# EAGLE board csa_ultracpu (EAGLE 6.4), part 1 of 3
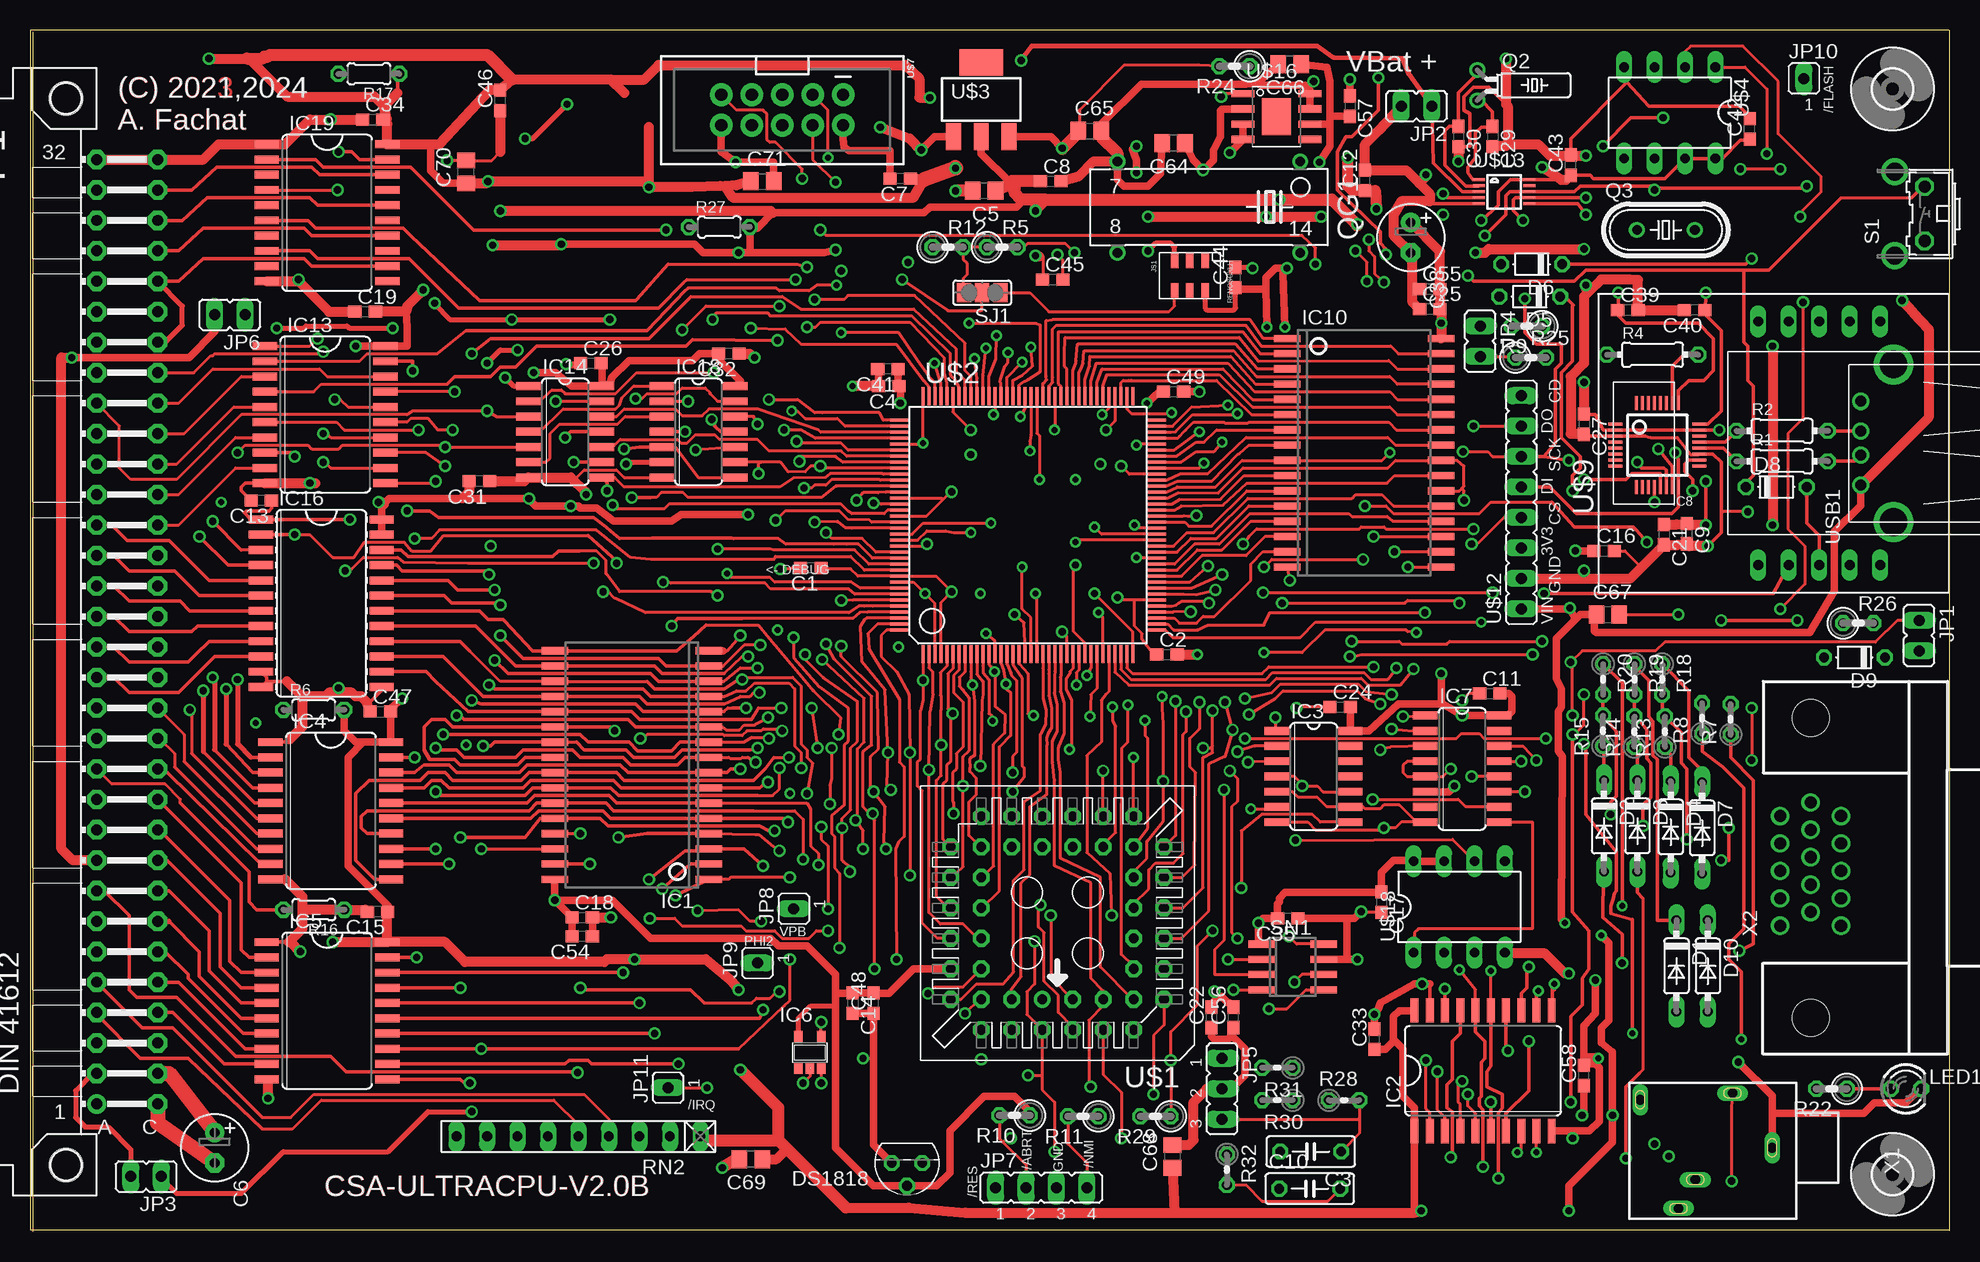
[diagram p7: board, top side]
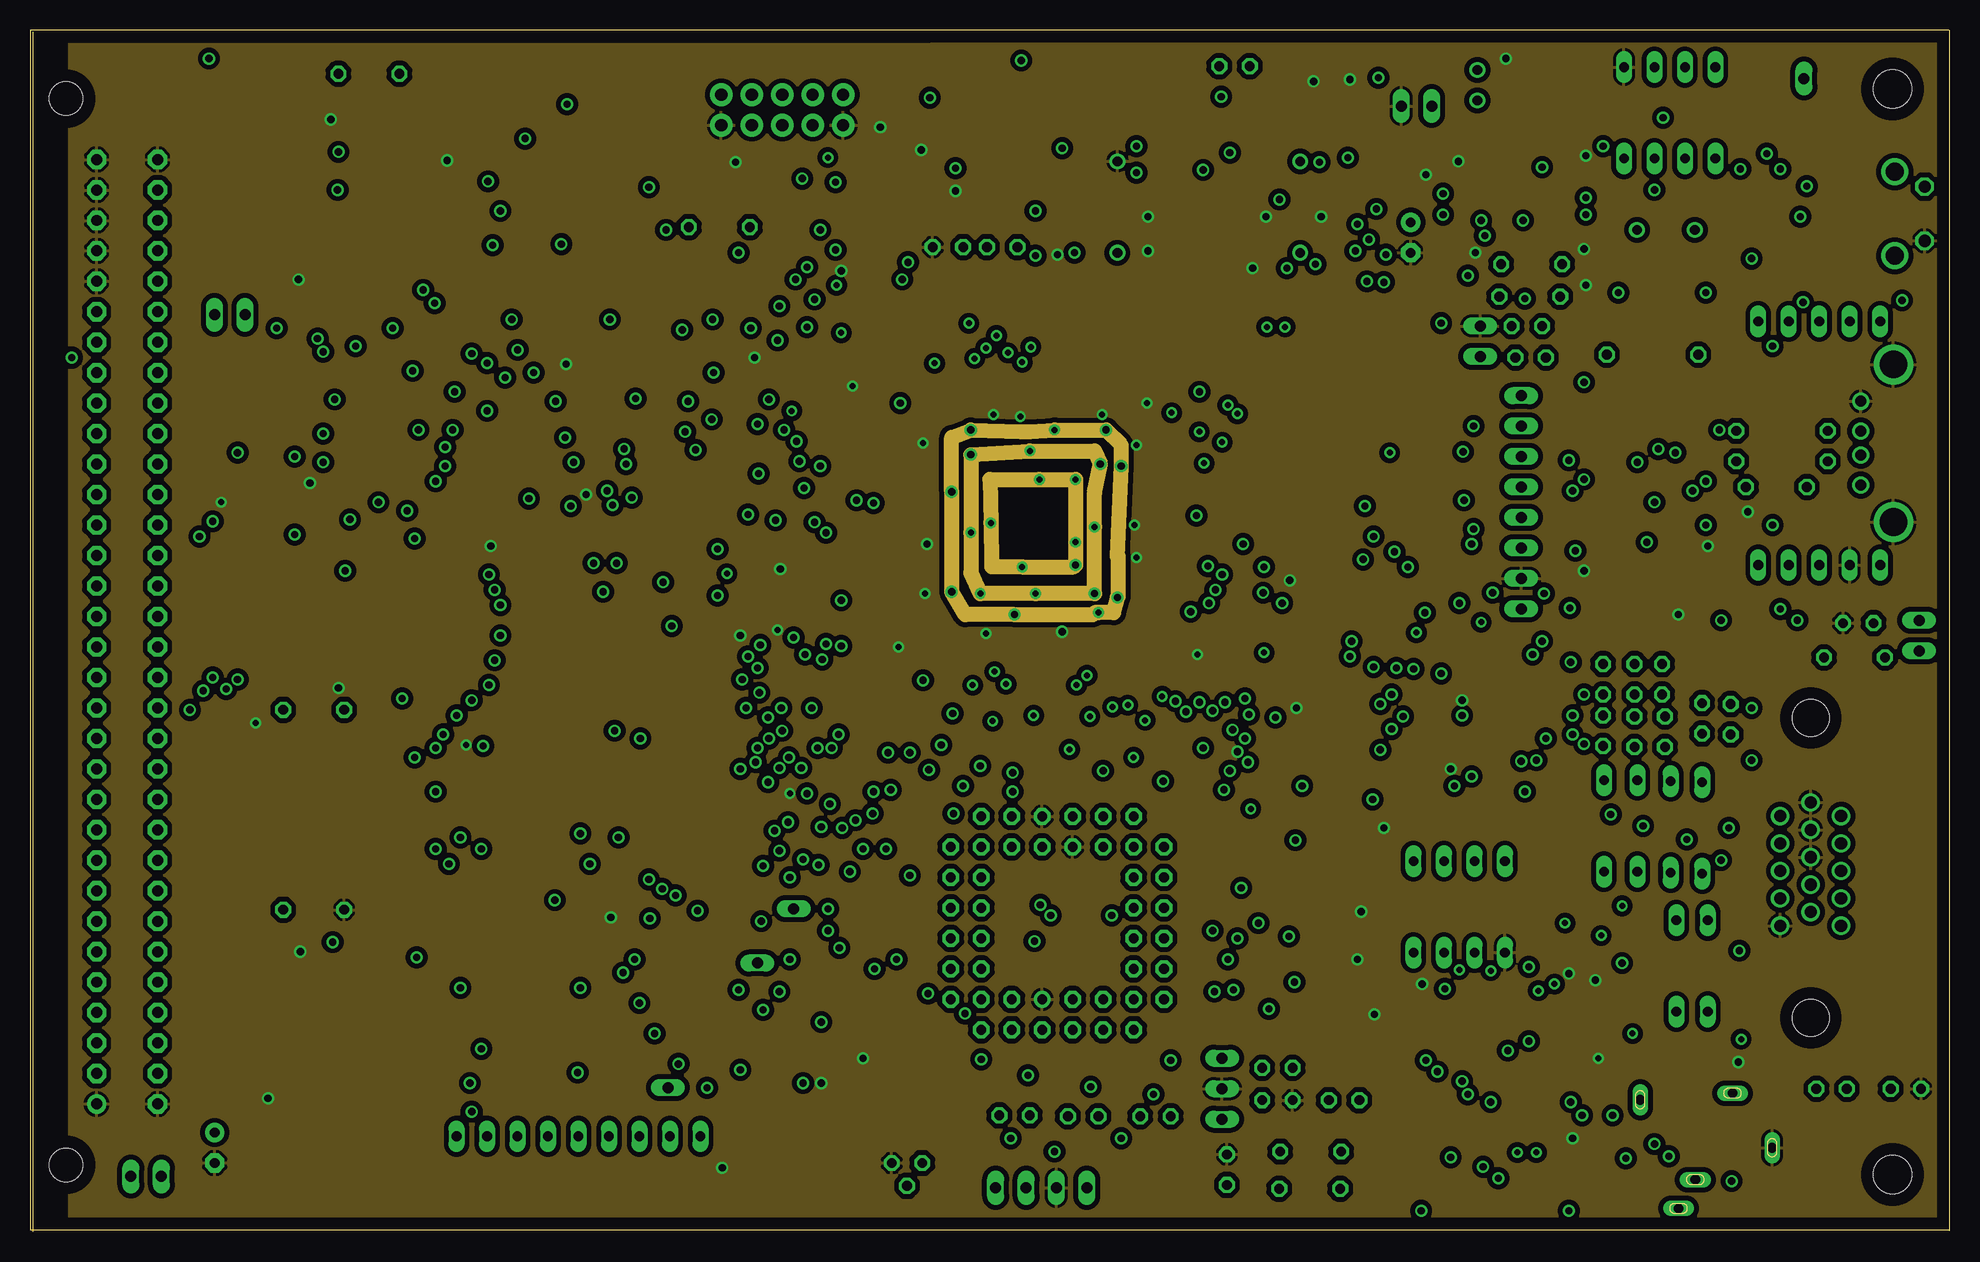
[diagram p8: board, inner layer Route2]
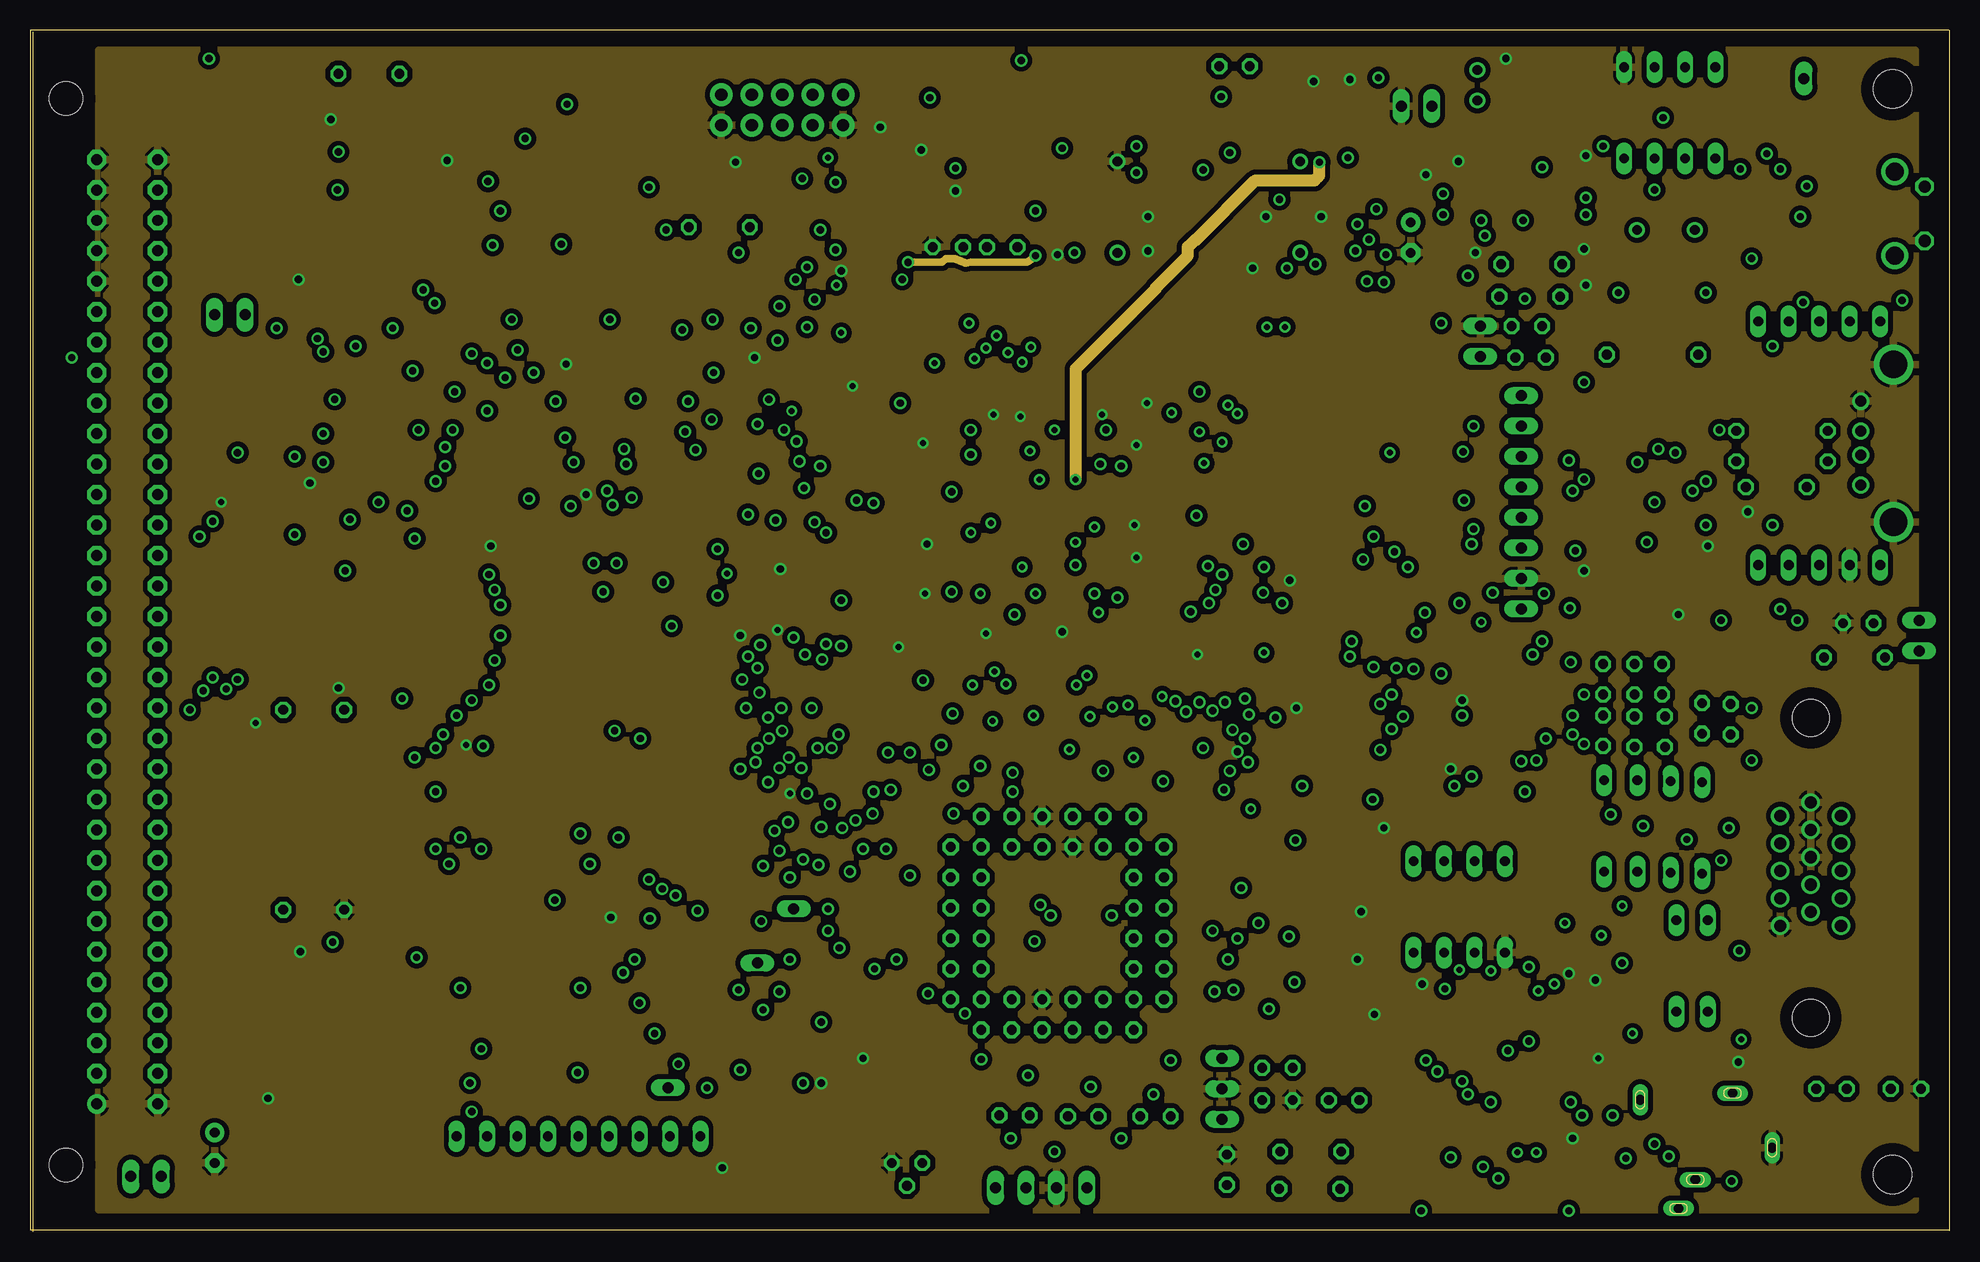
[diagram p9: board, inner layer Route15]
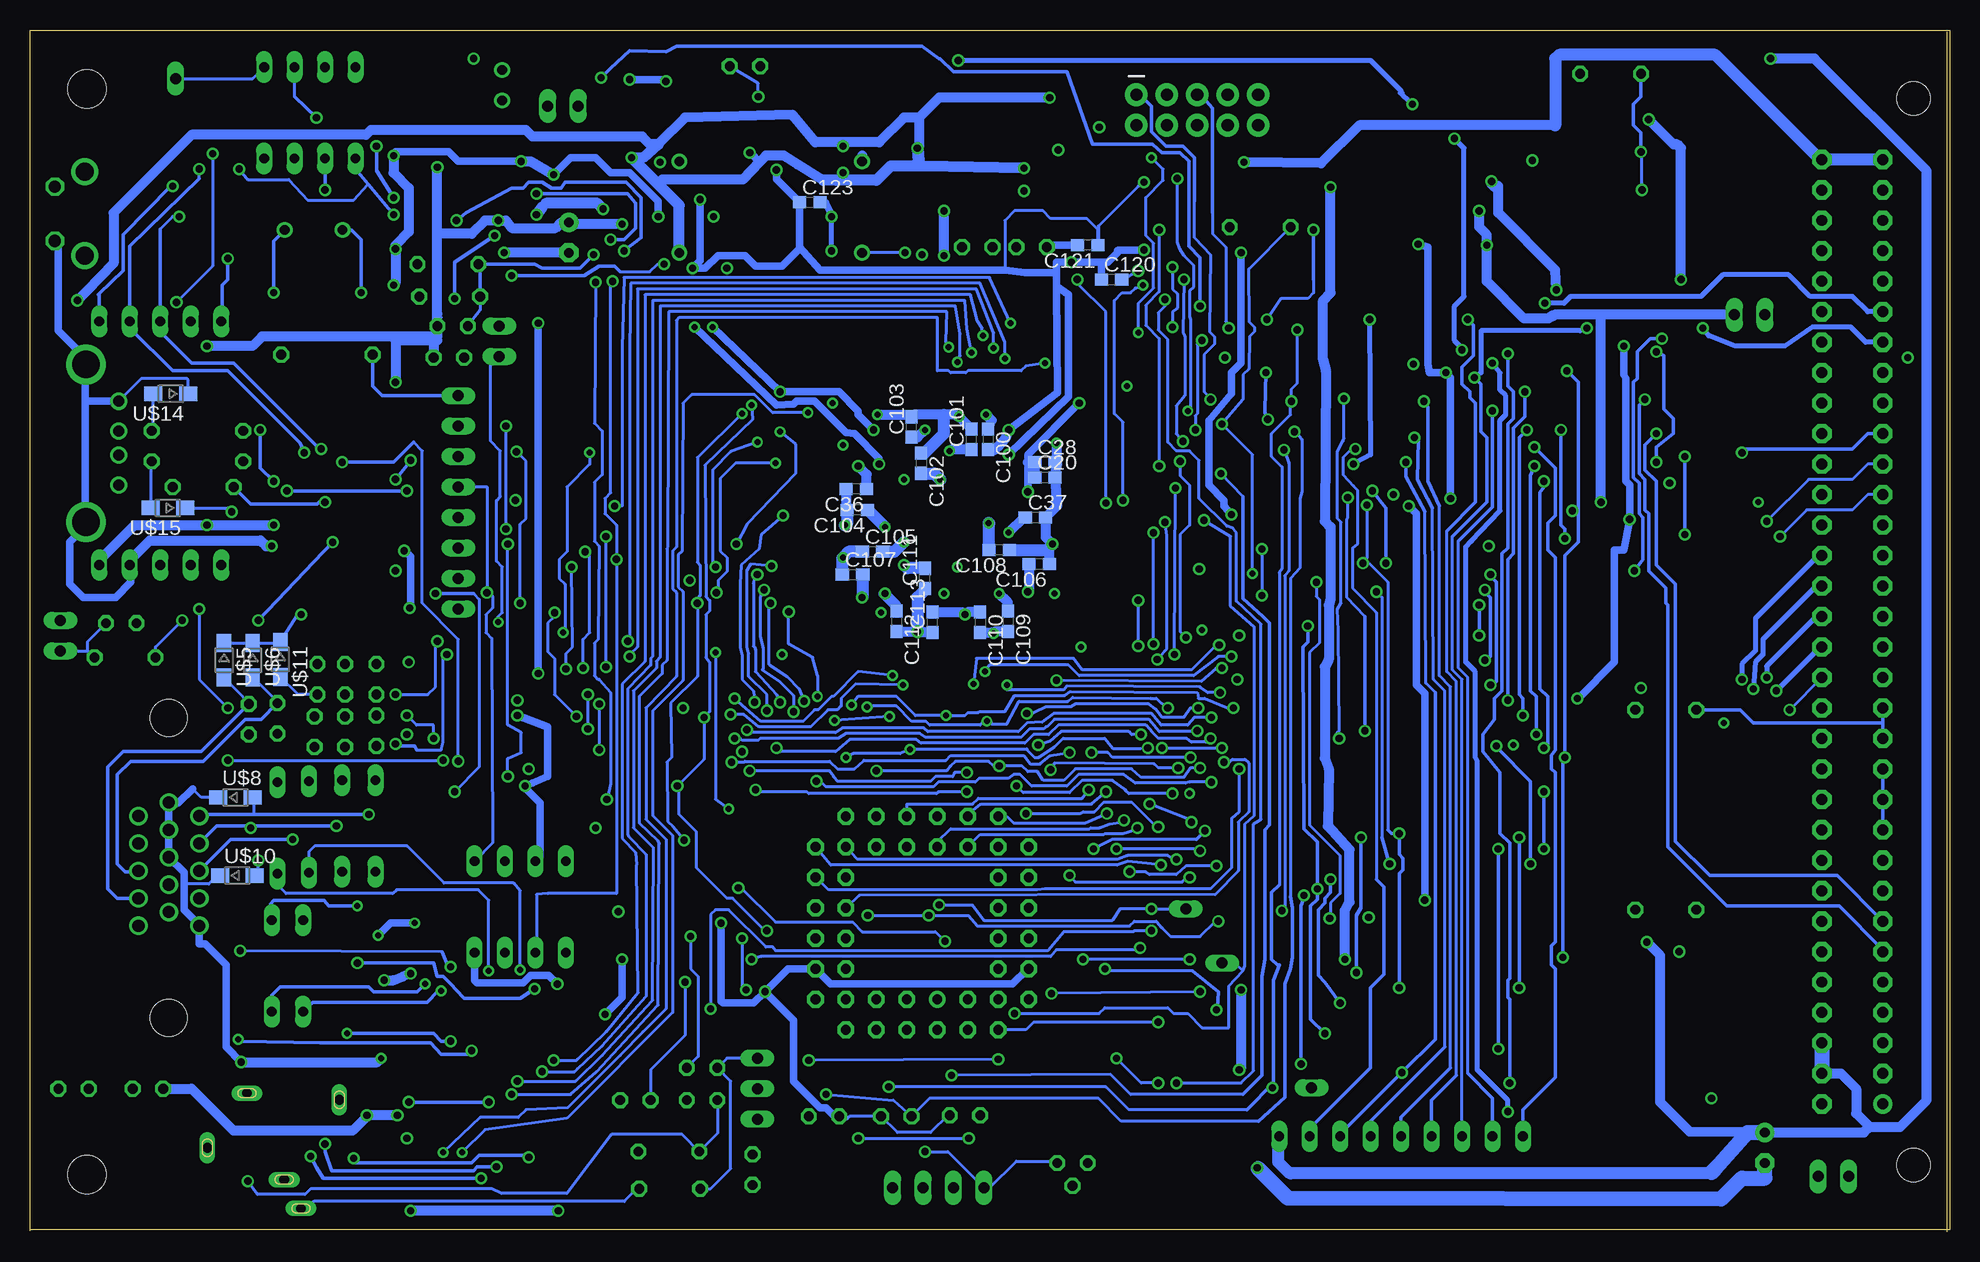
[diagram p10: board, bottom side, seen from below]

Size 160 x 100.18 mm. Coordinates in mm from the lower left corner, seen from the top.
Outline: 160,0.17 0,0.17 0,100.17 75,100.17 159.94,100.18
Outline: 160,0.09 160,100.17
Copper layers (1+2*15+16): Top 0.035mm / dielectric 0.2104mm / Route2 0.0152mm / dielectric 1.065mm / Route15 0.0152mm / dielectric 0.2104mm / Bottom 0.035mm
Design rules "default *": minimum track width 5mil, minimum drill 0.3mm, track to track 6mil, track to pad 6mil, pad to pad 6mil, via to via 6mil, smd to smd 6mil, copper to edge 40mil, drill to drill 8mil, minimum pad ring 10mil, minimum via ring 8mil, stop-mask expansion 4mil, vias tented up to drill 0mil, thermal gap 10mil
Net classes: 0 default: clearance 0.152 mm

## Footprints (pad centres in the part's own frame; a part is rotated, then mirrored left to right if it is on the bottom)
C0603 = smd 1.1 x 1: 1 -0.85,0; 2 0.85,0
C050-025X075 = drill 0.813 octagon: 1 -2.54,0; 2 2.54,0
C0805 = smd 1.3 x 1.5: 1 -0.95,0; 2 0.95,0
E2,5-6 = drill 0.813 pad 1.6: + -1.27,0 | drill 0.813 pad 1.6 octagon: - 1.27,0
DO35-7 = drill 0.813 long: A 3.81,0; C -3.81,0
D-5 = drill 0.813 octagon: A 2.54,0; C -2.54,0
TO92 = drill 0.813 octagon: 1 -1.27,1.27; 2 0,3.175; 3 1.27,1.27
3,2 = hole 3.2: 0,0
SOP32 = smd 0.6 x 2.2: 1 -8.89,-6.416; 2 -7.62,-6.416; 3 -6.35,-6.416; 4 -5.08,-6.416; 5 -3.81,-6.416; 6 -2.54,-6.416; 7 -1.27,-6.416; 8 0,-6.416; 9 1.27,-6.416; 10 2.54,-6.416; 11 3.81,-6.416; 12 5.08,-6.416; 13 6.35,-6.416; 14 7.62,-6.416; 15 8.89,-6.416; 16 10.16,-6.416; 17 10.16,6.416; 18 8.89,6.416; 19 7.62,6.416; 20 6.35,6.416; 21 5.08,6.416; 22 3.81,6.416; 23 2.54,6.416; 24 1.27,6.416; 25 0,6.416; 26 -1.27,6.416; 27 -2.54,6.416; 28 -3.81,6.416; 29 -5.08,6.416; 30 -6.35,6.416; 31 -7.62,6.416; 32 -8.89,6.416
SO20W = smd 0.66 x 2.032: 1 -5.715,-5.029; 2 -4.445,-5.029; 3 -3.175,-5.029; 4 -1.905,-5.029; 5 -0.635,-5.029; 6 0.635,-5.029; 7 1.905,-5.029; 8 3.175,-5.029; 9 4.445,-5.029; 10 5.715,-5.029; 11 5.715,5.029; 12 4.445,5.029; 13 3.175,5.029; 14 1.905,5.029; 15 0.635,5.029; 16 -0.635,5.029; 17 -1.905,5.029; 18 -3.175,5.029; 19 -4.445,5.029; 20 -5.715,5.029
SO14 = smd 0.66 x 2.032: 1 -3.81,-3.073; 2 -2.54,-3.073; 3 -1.27,-3.073; 4 0,-3.073; 5 1.27,-3.073; 6 2.54,-3.073; 7 3.81,-3.073; 8 3.81,3.073; 9 2.54,3.073; 10 1.27,3.073; 11 0,3.073; 12 -1.27,3.073; 13 -2.54,3.073; 14 -3.81,3.073
SOT23-5 = smd 0.69 x 0.99: 1 -0.95,-1.29; 2 0,-1.29; 3 0.95,-1.29; 4 0.95,1.3; 5 -0.95,1.3
SO16 = smd 0.66 x 2.032: 1 -4.445,-3.073; 2 -3.175,-3.073; 3 -1.905,-3.073; 4 -0.635,-3.073; 5 0.635,-3.073; 6 1.905,-3.073; 7 3.175,-3.073; 8 4.445,-3.073; 9 4.445,3.073; 10 3.175,3.073; 11 1.905,3.073; 12 0.635,3.073; 13 -0.635,3.073; 14 -1.905,3.073; 15 -3.175,3.073; 16 -4.445,3.073
TQFP32-5MM = smd 1.143 x 0.254: 1 -3.5,1.75; 2 -3.5,1.25; 3 -3.5,0.75; 4 -3.5,0.25; 5 -3.5,-0.25; 6 -3.5,-0.75; 7 -3.5,-1.25; 8 -3.5,-1.75; 17 3.5,-1.75; 18 3.5,-1.25; 19 3.5,-0.75; 20 3.5,-0.25; 21 3.5,0.25; 22 3.5,0.75; 23 3.5,1.25; 24 3.5,1.75 | smd 0.254 x 1.143: 9 -1.75,-3.5; 10 -1.25,-3.5; 11 -0.75,-3.5; 12 -0.25,-3.5; 13 0.25,-3.5; 14 0.75,-3.5; 15 1.25,-3.5; 16 1.75,-3.5; 25 1.75,3.5; 26 1.25,3.5; 27 0.75,3.5; 28 0.25,3.5; 29 -0.25,3.5; 30 -0.75,3.5; 31 -1.25,3.5; 32 -1.75,3.5
SO24L = smd 0.66 x 2.032: 1 -3.81,-5.029; 2 -2.54,-5.029; 3 -1.27,-5.029; 4 0,-5.029; 5 1.27,-5.029; 6 2.54,-5.029; 7 3.81,-5.029; 8 5.08,-5.029; 9 6.35,-5.029; 10 7.62,-5.029; 11 8.89,-5.029; 12 10.16,-5.029; 13 10.16,5.029; 14 8.89,5.029; 15 7.62,5.029; 16 6.35,5.029; 17 5.08,5.029; 18 3.81,5.029; 19 2.54,5.029; 20 1.27,5.029; 21 0,5.029; 22 -1.27,5.029; 23 -2.54,5.029; 24 -3.81,5.029
JP1 = drill 0.914 long: 1 0,-1.27; 2 0,1.27
JP2 = drill 0.914 long: 1 -2.54,0; 2 0,0; 3 2.54,0
JP4 = drill 0.914 long: 1 -3.81,0; 2 -1.27,0; 3 1.27,0; 4 3.81,0
PIN = drill 0.914 long: 1 0,0
RENJS6 = smd 0.635 x 1.27: 1 -3.81,-3.81; 2 -2.54,-3.81; 3 -1.27,-3.81; 4 -1.27,-1.27; 5 -2.54,-1.27; 6 -3.81,-1.27
LED3MM = drill 0.813 octagon: A -1.27,0; K 1.27,0
CSABUS = drill 0.914 pad 1.6: A1 7.62,36.83 | drill 0.914 pad 1.6 octagon: A2 7.62,34.29; A3 7.62,31.75; A4 7.62,29.21; A5 7.62,26.67; A6 7.62,24.13; A7 7.62,21.59; A8 7.62,19.05; A9 7.62,16.51; A10 7.62,13.97; A11 7.62,11.43; A12 7.62,8.89; A13 7.62,6.35; A14 7.62,3.81; A15 7.62,1.27; A16 7.62,-1.27; A17 7.62,-3.81; A18 7.62,-6.35; A19 7.62,-8.89; A20 7.62,-11.43; A21 7.62,-13.97; A22 7.62,-16.51; A23 7.62,-19.05; A24 7.62,-21.59; A25 7.62,-24.13; A26 7.62,-26.67; A27 7.62,-29.21; A28 7.62,-31.75; A29 7.62,-34.29; A30 7.62,-36.83; A31 7.62,-39.37; A32 7.62,-41.91; C1 2.54,36.83; C2 2.54,34.29; C3 2.54,31.75; C4 2.54,29.21; C5 2.54,26.67; C6 2.54,24.13; C7 2.54,21.59; C8 2.54,19.05; C9 2.54,16.51; C10 2.54,13.97; C11 2.54,11.43; C12 2.54,8.89; C13 2.54,6.35; C14 2.54,3.81; C15 2.54,1.27; C16 2.54,-1.27; C17 2.54,-3.81; C18 2.54,-6.35; C19 2.54,-8.89; C20 2.54,-11.43; C21 2.54,-13.97; C22 2.54,-16.51; C23 2.54,-19.05; C24 2.54,-21.59; C25 2.54,-24.13; C26 2.54,-26.67; C27 2.54,-29.21; C28 2.54,-31.75; C29 2.54,-34.29; C30 2.54,-36.83; C31 2.54,-39.37; C32 2.54,-41.91 | hole 2.794: 10.16,41.91; 10.16,-46.99
TC26H = drill 0.813: 1 -1.27,0; 2 1.27,0
HC49/S = drill 0.813: 1 -2.413,0; 2 2.413,0
SG51 = drill 0.813: 1 -7.62,-3.81; 7 7.62,-3.81; 8 7.62,3.81; 14 -7.62,3.81
0204/7 = drill 0.813 octagon: 1 -3.81,0; 2 3.81,0
0207/2V = drill 0.813 octagon: 1 -1.27,0; 2 1.27,0
0204/5 = drill 0.813 octagon: 1 -2.54,0; 2 2.54,0
0204V = drill 0.813 octagon: 1 -1.27,0; 2 1.27,0
RN-9 = drill 0.813 long: 1 -10.16,0; 2 -7.62,0; 3 -5.08,0; 4 -2.54,0; 5 0,0; 6 2.54,0; 7 5.08,0; 8 7.62,0; 9 10.16,0
B3F-31XX = drill 1.016 octagon: 1 -2.261,-1.245; 2 2.261,-1.245 | drill 1.499 pad 2.159: 3 -3.505,1.245; 4 3.505,1.245
SJ_2 = smd 1.168 x 1.6: 1 -1.524,0; 2 0,0; 3 1.524,0
SOIC8 = smd 0.6 x 2.2: 1 -1.905,-2.6; 2 -0.635,-2.6; 3 0.635,-2.6; 4 1.905,-2.6; 5 1.905,2.6; 6 0.635,2.6; 7 -0.635,2.6; 8 -1.905,2.6
PLCC44 = drill 0.813 pad 1.397: 1 1.27,6.35 | drill 0.813 pad 1.397 octagon: 2 -1.27,8.89; 3 -1.27,6.35; 4 -3.81,8.89; 5 -3.81,6.35; 6 -6.35,8.89; 7 -8.89,6.35; 8 -6.35,6.35; 9 -8.89,3.81; 10 -6.35,3.81; 11 -8.89,1.27; 12 -6.35,1.27; 13 -8.89,-1.27; 14 -6.35,-1.27; 15 -8.89,-3.81; 16 -6.35,-3.81; 17 -8.89,-6.35; 18 -6.35,-8.89; 19 -6.35,-6.35; 20 -3.81,-8.89; 21 -3.81,-6.35; 22 -1.27,-8.89; 23 -1.27,-6.35; 24 1.27,-8.89; 25 1.27,-6.35; 26 3.81,-8.89; 27 3.81,-6.35; 28 6.35,-8.89; 29 8.89,-6.35; 30 6.35,-6.35; 31 8.89,-3.81; 32 6.35,-3.81; 33 8.89,-1.27; 34 6.35,-1.27; 35 8.89,1.27; 36 6.35,1.27; 37 8.89,3.81; 38 6.35,3.81; 39 8.89,6.35; 40 6.35,8.89; 41 6.35,6.35; 42 3.81,8.89; 43 3.81,6.35; 44 1.27,8.89
TQFP144 = smd 0.27 x 1.5: 1 -8.75,-12.02; 2 -8.25,-12.02; 3 -7.75,-12.02; 4 -7.25,-12.02; 5 -6.75,-12.02; 6 -6.25,-12.02; 7 -5.75,-12.02; 8 -5.25,-12.02; 9 -4.75,-12.02; 10 -4.25,-12.02; 11 -3.75,-12.02; 12 -3.25,-12.02; 13 -2.75,-12.02; 14 -2.25,-12.02; 15 -1.75,-12.02; 16 -1.25,-12.02; 17 -0.75,-12.02; 18 -0.25,-12.02; 19 0.25,-12.02; 20 0.75,-12.02; 21 1.25,-12.02; 22 1.75,-12.02; 23 2.25,-12.02; 24 2.75,-12.02; 25 3.25,-12.02; 26 3.75,-12.02; 27 4.25,-12.02; 28 4.75,-12.02; 29 5.25,-12.02; 30 5.75,-12.02; 31 6.25,-12.02; 32 6.75,-12.02; 33 7.25,-12.02; 34 7.75,-12.02; 35 8.25,-12.02; 36 8.75,-12.02; 73 8.75,9.48; 74 8.25,9.48; 75 7.75,9.48; 76 7.25,9.48; 77 6.75,9.48; 78 6.25,9.48; 79 5.75,9.48; 80 5.25,9.48; 81 4.75,9.48; 82 4.25,9.48; 83 3.75,9.48; 84 3.25,9.48; 85 2.75,9.48; 86 2.25,9.48; 87 1.75,9.48; 88 1.25,9.48; 89 0.75,9.48; 90 0.25,9.48; 91 -0.25,9.48; 92 -0.75,9.48; 93 -1.25,9.48; 94 -1.75,9.48; 95 -2.25,9.48; 96 -2.75,9.48; 97 -3.25,9.48; 98 -3.75,9.48; 99 -4.25,9.48; 100 -4.75,9.48; 101 -5.25,9.48; 102 -5.75,9.48; 103 -6.25,9.48; 104 -6.75,9.48; 105 -7.25,9.48; 106 -7.75,9.48; 107 -8.25,9.48; 108 -8.75,9.48 | smd 1.5 x 0.27: 37 10.75,-10.02; 38 10.75,-9.52; 39 10.75,-9.02; 40 10.75,-8.52; 41 10.75,-8.02; 42 10.75,-7.52; 43 10.75,-7.02; 44 10.75,-6.52; 45 10.75,-6.02; 46 10.75,-5.52; 47 10.75,-5.02; 48 10.75,-4.52; 49 10.75,-4.02; 50 10.75,-3.52; 51 10.75,-3.02; 52 10.75,-2.52; 53 10.75,-2.02; 54 10.75,-1.52; 55 10.75,-1.02; 56 10.75,-0.52; 57 10.75,-0.02; 58 10.75,0.48; 59 10.75,0.98; 60 10.75,1.48; 61 10.75,1.98; 62 10.75,2.48; 63 10.75,2.98; 64 10.75,3.48; 65 10.75,3.98; 66 10.75,4.48; 67 10.75,4.98; 68 10.75,5.48; 69 10.75,5.98; 70 10.75,6.48; 71 10.75,6.98; 72 10.75,7.48; 109 -10.75,7.48; 110 -10.75,6.98; 111 -10.75,6.48; 112 -10.75,5.98; 113 -10.75,5.48; 114 -10.75,4.98; 115 -10.75,4.48; 116 -10.75,3.98; 117 -10.75,3.48; 118 -10.75,2.98; 119 -10.75,2.48; 120 -10.75,1.98; 121 -10.75,1.48; 122 -10.75,0.98; 123 -10.75,0.48; 124 -10.75,-0.02; 125 -10.75,-0.52; 126 -10.75,-1.02; 127 -10.75,-1.52; 128 -10.75,-2.02; 129 -10.75,-2.52; 130 -10.75,-3.02; 131 -10.75,-3.52; 132 -10.75,-4.02; 133 -10.75,-4.52; 134 -10.75,-5.02; 135 -10.75,-5.52; 136 -10.75,-6.02; 137 -10.75,-6.52; 138 -10.75,-7.02; 139 -10.75,-7.52; 140 -10.75,-8.02; 141 -10.75,-8.52; 142 -10.75,-9.02; 143 -10.75,-9.52; 144 -10.75,-10.02
SOT223 = smd 1.219 x 2.235: 1 -2.311,-3.099; 2 0,-3.099; 3 2.311,-3.099 | smd 3.6 x 2.2: 4 0,3.099
DIL08 = drill 0.813 long: 1 -11.43,-2.54; 2 -8.89,-2.54; 3 -6.35,-2.54; 4 -3.81,-2.54; 5 -3.81,5.08; 6 -6.35,5.08; 7 -8.89,5.08; 8 -11.43,5.08
SOD323 = smd 1.5 x 1.2: 1 -1.45,0; 2 1.45,0
FLAT10BOX = drill 1.016 pad 1.88: 1 -1.27,5.08; 2 1.27,5.08; 3 -1.27,2.54; 4 1.27,2.54; 5 -1.27,0; 6 1.27,0; 7 -1.27,-2.54; 8 1.27,-2.54; 9 -1.27,-5.08; 10 1.27,-5.08
ETHOLIENC = drill 0.813 long: 1_1 15.24,10.16; 1_2 12.7,10.16; 1_3 10.16,10.16; 1_4 7.62,10.16; 1_5 5.08,10.16; 2_1 5.08,-10.16; 2_2 7.62,-10.16; 2_3 10.16,-10.16; 2_4 12.7,-10.16; 2_5 15.24,-10.16
GRAVITECH-SDCARD = drill 0.914 long: 3V3 -3.81,0; CD 8.89,0; CS -1.27,0; DI 1.27,0; DO 6.35,0; GND -6.35,0; SCK 3.81,0; VIN -8.89,0
MSOP10 = smd 0.25 x 1: 1 -1,-2.113; 2 -0.5,-2.113; 3 0,-2.113; 4 0.5,-2.113; 5 1,-2.113; 6 1,2.113; 7 0.5,2.113; 8 0,2.113; 9 -0.5,2.113; 10 -1,2.113
PSOP-8-FIXED = smd 1.91 x 0.61: 1 -2.78,1.905; 2 -2.78,0.635; 3 -2.78,-0.635; 4 -2.78,-1.905; 5 2.78,-1.905; 6 2.78,-0.635; 7 2.78,0.635; 8 2.78,1.905 | smd 2.41 x 3.1: PAD 0,0
USB-A-H = drill 0.914: D+ 2.718,-1.003; D- 2.718,1.003; GND 2.718,-3.493; VBUS 2.718,3.493 | drill 2.311: GND@1 0,6.566; GND@2 0,-6.566
1503_09 = drill 0.8 pad 1.2 long: 1 0,-2.1; 2 -4.55,-5.4; 3 5.05,-9.9; 4 -4,-13.1; 5 2.65,-8.5
HDR15RA = drill 1.016: 1 4.318,2.54; 2 2.032,2.54; 3 -0.254,2.54; 4 -2.54,2.54; 5 -4.826,2.54; 6 5.461,0; 7 3.175,0; 8 0.889,0; 9 -1.397,0; 10 -3.683,0; 11 4.318,-2.54; 12 2.032,-2.54; 13 -0.254,-2.54; 14 -2.54,-2.54; 15 -4.826,-2.54 | hole 3.048: -12.497,0; 12.497,0

## Placement (x,y rotation side)
C1  1u  [C0603]  65.08,55.33 180 top
C2  0.1u  [C0603]  94.77,48.11 0 top
C3  1u  [C050-025X075]  106.75,6.67 180 top
C4  1u  [C0603]  71.59,70.49 180 top
C5  22u  [C0805]  79.53,86.76 180 top
C6  47u  [E2,5-6]  15.39,6.99 270 top
C7  100n  [C0603]  72.54,87.8 180 top
C8  100n  [C0603]  85.08,87.56 0 top
C9  1.0u Cer  [C0603]  138.11,58.19 270 top
C10  1u  [C050-025X075]  106.67,3.58 0 top
C11  0.1u  [C0603]  121.68,44.85 0 top
C12  0.1u  [C0603]  111.28,87.64 90 top
C13  0.1u  [C0603]  19.28,60.97 180 top
C14  1u  [C0603]  68.57,19.06 270 top
C15  0.1u  [C0603]  28.97,26.68 180 top
C16  0.1u  [C0603]  131.2,56.76 0 top
C17  0.1u  [C0603]  112.63,27.47 270 top
C18  0.1u  [C0603]  46.03,26.2 0 top
C19  0.1u  [C0603]  27.93,76.68 0 top
C20  0.1u  [C0603]  75.4,62.87 0 bottom
C21  0.1u  [C0603]  136.2,58.11 270 top
C22  0.1u  [C0603]  98.5,17.87 90 top
C24  0.1u  [C0603]  109.21,43.74 0 top
C25  0.1u  [C0603]  116.68,76.92 0 top
C26  0.1u  [C0603]  46.75,72.4 0 top
C27  0.1u  [C0603]  129.53,67.32 270 top
C28  0.1u  [C0603]  75.4,64.14 0 bottom
C29  18p  [C0603]  121.91,91.29 270 top
C30  18p  [C0603]  119.06,91.29 270 top
C31  0.1u  [C0603]  37.46,62.55 180 top
C32  0.1u  [C0603]  58.26,73.19 180 top
C33  0.1u  [C0603]  112.07,16.04 90 top
C34  0.1u  [C0603]  28.57,92.72 0 top
C35  0.1u  [C0603]  104.85,26.12 180 top
C36  0.1u  [C0603]  91.12,61.92 180 bottom
C37  0.1u  [C0603]  76.19,59.54 0 bottom
C38  22u  [E2,5-6]  115.09,82.87 270 top
C39  18p  [C0603]  133.19,76.84 0 top
C40  18p  [C0603]  138.74,76.84 180 top
C41  0.1u  [C0603]  71.51,71.92 180 top
C42  0.1u  [C0603]  143.35,91.92 90 top
C43  0.1u  [C0603]  128.42,88.91 90 top
C44  0.1u  [C0603]  100.48,79.54 90 top
C45  0.1u  [C0603]  85.24,79.38 0 top
C46  0.1u  [C0603]  39.21,94.3 90 top
C47  0.1u  [C0603]  29.2,43.35 0 top
C48  0.1u  [C0603]  70.32,19.06 90 top
C49  1u  [C0603]  95.32,70.02 0 top
C54  1u  [C0603]  46.03,24.61 180 top
C55  1u  [C0603]  116.68,78.59 0 top
C56  1u  [C0603]  100.32,17.87 90 top
C57  1u  [C0603]  110.01,93.83 270 top
C58  0.1u  [C0603]  129.53,13.02 90 top
C64  22u  [C0805]  95.32,90.73 180 top
C65  22u  [C0805]  88.34,91.76 0 top
C66  22u  [C0805]  105.01,97.32 180 top
C67  22u  [C0805]  131.52,51.44 0 top
C68  22u  [C0805]  95.24,6.28 90 top
C69  22u  [C0805]  60.08,6.04 180 top
C70  22u  [C0805]  36.35,88.35 90 top
C71  22u  [C0805]  61.03,87.56 0 top
C100  0.1u  [C0603]  80.16,66.05 270 bottom
C101  0.1u  [C0603]  81.51,66.05 90 bottom
C102  0.1u  [C0603]  85.72,64.06 270 bottom
C103  0.1u  [C0603]  86.51,67.08 90 bottom
C104  0.1u  [C0603]  91.04,60.17 180 bottom
C105  0.1u  [C0603]  89.77,56.68 0 bottom
C106  0.1u  [C0603]  75.88,55.65 180 bottom
C107  0.1u  [C0603]  91.44,54.78 0 bottom
C108  0.1u  [C0603]  79.21,56.84 180 bottom
C109  0.1u  [C0603]  78.5,50.89 270 bottom
C110  0.1u  [C0603]  80.8,50.81 270 bottom
C111  0.1u  [C0603]  85.4,54.46 90 bottom
C112  0.1u  [C0603]  87.78,50.89 270 bottom
C113  0.1u  [C0603]  84.77,50.81 90 bottom
C120  1u  [C0603]  69.84,79.38 0 bottom
C121  1u  [C0603]  71.83,82.24 180 bottom
C123  1u  [C0603]  95.01,85.81 0 bottom
D1  1N4148DO35-7  [DO35-7]  137.23,22.15 270 top
D2  1N4148DO35-7  [DO35-7]  131.2,33.82 270 top
D3  1N4148DO35-7  [DO35-7]  133.98,33.82 270 top
D4  1N4148DO35-7  [DO35-7]  136.76,33.74 270 top
D5  1N4148  [D-5]  125.01,77.95 180 top
D6  1N4148  [D-5]  125.17,80.65 180 top
D7  1N4148DO35-7  [DO35-7]  139.38,33.66 270 top
D8  1N4148  [D-5]  145.57,62.08 0 top
D9  1N4148  [D-5]  152.08,47.87 180 top
D10  1N4148DO35-7  [DO35-7]  139.85,22.15 270 top
DS1818  DS1818  [TO92]  73.1,6.99 180 top
H3  MOUNT-HOLE3.2  [3,2]  155.25,95.26 0 top
H4  MOUNT-HOLE3.2  [3,2]  155.25,4.77 0 top
IC1  RAMSOCK32TO512KSOP  [SOP32]  50.16,38.27 90 top
IC2  74HCT245DW  [SO20W]  121.12,13.42 0 top
IC3  74LVC125  [SO14]  106.99,37.95 270 top
IC4  74HCT245DW  [SO20W]  25.08,35.09 270 top
IC5  74HCT245DW  [SO20W]  24.76,18.42 270 top
IC6  74LVC1G04DBV  [SOT23-5]  65,14.93 0 top
IC7  74LVC138  [SO16]  119.38,38.58 270 top
IC8  MAX3421E  [TQFP32-5MM]  135.65,65.57 0 top
IC10  RAMSOCK32TO512KSOP  [SOP32]  111.2,65.57 270 top
IC13  74HCT244DW  [SO20W]  24.6,68.11 270 top
IC14  74LVC14  [SO14]  44.6,66.68 270 top
IC16  74LVC8T245SO24  [SO24L]  24.28,55.57 270 top
IC18  74LVC06  [SO14]  55.72,66.68 270 top
IC19  74HCT244DW  [SO20W]  24.76,84.94 270 top
JP1  [JP1]  157.47,49.7 180 top
JP2  [JP1]  115.56,93.83 90 top
JP3  [JP1]  9.68,4.61 90 top
JP4  [JP1]  120.88,74.22 180 top
JP5  [JP2]  99.37,11.91 270 top
JP6  [JP1]  16.66,76.44 90 top
JP7  [JP4]  84.29,3.66 0 top
JP8  PIN  [PIN]  63.65,26.91 90 top
JP9  PIN  [PIN]  60.64,22.39 90 top
JP10  PIN  [PIN]  147.87,96.13 0 top
JP11  PIN  [PIN]  53.18,11.99 90 top
JS1  RENOSCXLH  [RENJS6]  94.13,77.16 180 top
LED1  [LED3MM]  156.36,11.91 0 top
P1  CSABUS  [CSABUS]  13.17,47.47 180 top
Q2  32kHz  [TC26H]  120.64,95.57 270 top
Q3  12MHz  [HC49/S]  136.36,83.51 0 top
QG1  50MHz  [SG51]  98.26,85.41 180 top
R1  33  [0204/7]  146.04,64.22 0 top
R2  33  [0204/7]  146.04,66.76 0 top
R4  33  [0204/7]  135.25,73.11 0 top
R5  1k  [0207/2V]  81.04,82.08 0 top
R6  10k  [0204/5]  23.65,43.5 0 top
R7  68  [0204V]  141.76,42.71 90 top
R8  68  [0204V]  139.38,42.79 90 top
R9  10k  [0207/2V]  124.77,75.49 180 top
R10  10k  [0207/2V]  82.07,9.69 180 top
R11  10k  [0207/2V]  87.78,9.61 180 top
R12  1k5  [0207/2V]  76.51,82.08 0 top
R13  470  [0204V]  136.28,41.68 90 top
R14  470  [0204V]  133.74,41.68 90 top
R15  470  [0204V]  131.12,41.76 90 top
R16  10k  [0204/5]  23.65,26.84 180 top
R17  10k  [0204/5]  28.25,96.53 180 top
R18  1k  [0204V]  136.04,46.04 270 top
R19  1k  [0204V]  133.74,46.04 270 top
R20  1k  [0204V]  131.12,46.04 270 top
R22  390  [0207/2V]  150.17,11.91 180 top
R24  10k  [0207/2V]  100.4,97.16 180 top
R25  4k7  [0207/2V]  125.09,72.87 0 top
R26  10k  [0207/2V]  152.39,50.73 0 top
R27  10k  [0204/5]  57.46,83.75 0 top
R28  100  [0204V]  109.53,10.96 0 top
R29  330  [0207/2V]  93.82,9.61 180 top
R30  680  [0204V]  103.98,10.96 180 top
R31  100  [0204V]  103.98,13.66 180 top
R32  680  [0204V]  99.77,5.17 270 top
RN2  10k  [RN-9]  45.72,7.94 180 top
S1  [B3F-31XX]  156.68,84.86 90 top
SJ1  [SJ_2]  79.37,78.27 180 top
SN1  MCP48X2  [SOIC8]  105.25,22.07 270 top
U$1  W65C816SPLCC  [PLCC44]  85.64,25.72 180 top
U$2  XC6SLX9-TQG144  [TQFP144]  83.18,60.17 0 top
U$3  LDI1117  [SOT223]  79.29,94.38 0 top
U$4  SPIFLASH  [DIL08]  129.06,94.54 180 top
U$5  PESD5V0L1BA  [SOD323]  143.82,47.63 270 bottom
U$6  PESD5V0L1BA  [SOD323]  141.44,47.63 270 bottom
U$7  XILINXPROG  [FLAT10BOX]  62.7,93.51 270 top
U$8  PESD5V0L1BA  [SOD323]  142.87,36.2 0 bottom
U$9  ETHOLIENC  [ETHOLIENC]  138.98,65.73 0 top
U$10  PESD5V0L1BA  [SOD323]  142.71,29.69 0 bottom
U$11  PESD5V0L1BA  [SOD323]  139.14,47.71 270 bottom
U$12  SD-CARD-GRAVI  [GRAVITECH-SDCARD]  124.3,60.81 90 top
U$13  MCP79510  [MSOP10]  122.87,86.68 270 top
U$14  PESD5V0L1BA  [SOD323]  148.27,69.86 180 bottom
U$15  PESD5V0L1BA  [SOD323]  148.51,60.33 180 bottom
U$16  AP2132B-1.2  [PSOP-8-FIXED]  103.9,92.95 0 top
U$18  SPIFLASH  [DIL08]  126.76,25.8 0 top
USB1  USB-A-H  [USB-A-H]  155.33,65.73 180 top
X1  SJ1-3513N  [1503_09]  147.31,6.99 270 top
X2  D-SUB15-HDR15RA  [HDR15RA]  148.43,30.33 90 top

## Tracks (layer width: path | path; a pad name or v marks a point on that pad's centre or on a via)
12MHZ  (via drill 0.6)
  Top 0.305: v139.69,78.27 139.69,77.69 C40.1 139.75,76.31 140.97,75.1 140.97,68.43 139.85,67.32 IC8.24
  Bottom 0.305: Q3.2 138.77,83.48 139.69,82.56 v139.69,78.27
50M  (via drill 0.6)
  Top 0.254: v72.7,79.38 76.51,76.76 79.21,76.76 79.37,76.84 SJ1.2 | v70.32,60.73 70.95,60.64 70.95,60.65 U$2.123
  Bottom 0.254: v70.32,60.73 70.32,76.68 72.54,78.91 v72.7,79.38
50MCAN
  Top 0.254: 80.16,81.68 R5.1 R12.2 77.78,81.05 78.1,80.73 78.1,79.78 77.78,79.46 77.78,78.33 SJ1.3
50MSMD
  Top 0.254: SJ1.1 83.34,78.27 84.93,76.68 94.93,76.68 95.4,77.16 JS1.4
/BBE  (via drill 0.6)
  Top 0.305: P1.A8 6.19,28.42 8.25,26.36 8.25,20.17 8.89,19.53 12.22,19.53 17.14,14.61 25.08,14.61 26.35,13.34 45.56,13.34 v45.64,13.26 | IC14.9 v45.32,64.14
  Bottom 0.254: 42.86,44.93 43.65,45.73 43.73,60.01
  Bottom 0.305: RN2.3 50.8,8.1 v45.64,13.26 42.86,16.04 42.86,44.93 | 43.73,60.01 45.32,62.95 v45.32,64.14
/BE  (via drill 0.6)
  Top 0.254: IC6.2 65,12.94 v64.45,12.39 | U$2.100 78.43,71.27 77.94,71.76 77.94,74.06 73.73,78.03 68.18,78.03 67.86,77.71 v65.4,77.71
  Bottom 0.254: v64.45,12.39 59.05,12.39 58.02,13.42 58.02,33.98 57.38,34.38 57.38,50.65 59.45,52.55 59.45,58.27 59.76,58.66 60.24,58.82 62.54,61.13 62.54,64.3 63.34,65.09 64.45,65.09 65.16,65.81 65.16,74.38 65.96,75.17 65.96,76.6 65.4,77.16 v65.4,77.71
/BE_DOUT  (via drill 0.6)
  Top 0.254: 45.79,56.76 47.22,56.76 48.02,55.97 48.02,54.85 49.13,53.35 56.75,53.35 v57.3,53.03 | v57.3,56.92 61.67,56.92 61.99,56.84 68.57,56.84 68.74,56.83 69.92,55.65 U$2.133
  Top 0.305: IC16.22 30.95,56.84 31.51,56.28 43.57,56.28 44.05,56.76 45.79,56.76
  Bottom 0.254: v57.3,56.92 v57.3,53.03
/BE_OUT  (via drill 0.6)
  Top 0.254: 58.65,57.79 62.38,57.79 63.02,57.32 66.99,57.32 68.09,57.31 68.1,57.32 69.05,57.32 70.21,56.15 U$2.132
  Top 0.305: IC5.19 v32.22,22.87 | v32.06,39.54 IC4.19 | IC13.19 31.9,72.56 v31.9,71.76 | 58.65,57.79 58.48,57.8 51.84,57.8 49.13,57.79 48.41,58.43 48.02,58.74 46.98,59.54 34.05,59.54 33.33,60.09 v31.43,60.09
  Bottom 0.305: v32.22,22.87 32.22,39.38 v32.06,39.54 32.06,56.36 30.95,57.47 30.95,60.09 | 30.95,60.09 30.95,70.81 v31.9,71.76 | v31.43,60.09 30.95,60.09
/BEXTIO  (via drill 0.6)
  Top 0.254: 19.36,9.53 21.74,9.53 23.65,11.44 46.19,11.44 48.26,9.37 RN2.4
  Top 0.305: P1.A5 9.36,16.99 11.9,16.99 19.36,9.53 | v44.6,66.21 45.08,66.68 IC14.11
  Bottom 0.254: 42.06,15.41 42.06,45.09 43.02,46.04 43.1,60.33
  Bottom 0.305: RN2.4 48.26,9.21 42.06,15.41 | 43.1,60.33 44.37,62.71 44.29,66.05 v44.6,66.21
/BIOINH  (via drill 0.6)
  Top 0.254: 19.36,8.58 21.9,8.58 24.28,10.96 43.65,10.96 45.72,8.9 RN2.5 | v43.81,69.22 IC14.13
  Top 0.305: 5.55,18.1 9.2,14.45 13.17,14.45 19.36,8.58
  Top 0.406: P1.A4 5.55,18.1
  Bottom 0.254: 41.59,13.66 41.59,45.41 42.54,46.36 42.54,60.49
  Bottom 0.305: RN2.5 45.72,9.53 41.59,13.66 | 42.54,60.49 43.49,62.55 43.49,68.75 43.81,69.06 v43.81,69.22
/BIOSEL  (via drill 0.6)
  Top 0.254: v24.44,66.52 24.76,66.52 25.08,66.21 IC13.14
  Bottom 0.305: P1.A7 9.36,29.69 20,29.69 22.86,32.55 22.86,53.98 24.44,55.57 24.44,62.55 25.39,63.51 25.39,65.57 v24.44,66.52
/BIRQ  (via drill 0.6)
  Top 0.254: IC14.3 38.89,67.95 v38.1,68.43 31.9,68.43 31.43,68.11 17.62,68.11 12.22,62.71 8.41,62.71 7.46,63.67 7.46,67.16 P1.A24
  Bottom 0.254: 40.16,13.18 40.16,46.2 40.95,47 40.95,57.55
  Bottom 0.305: RN2.8 38.1,11.12 40.16,13.18 | 40.95,57.55 38.1,60.41 v38.1,68.43
/BMEMSEL  (via drill 0.6)
  Top 0.254: v25.39,69.38 25.87,69.38 26.51,68.75 IC13.16
  Bottom 0.305: P1.A6 5.55,23.5 9.2,27.15 18.57,27.15 23.49,32.07 23.49,52.24 23.65,52.39 23.65,53.66 25.08,55.09 25.08,59.86 25.39,60.17 25.39,62.71 25.87,63.19 25.87,68.9 25.55,69.22 v25.39,69.38
/BNMI  (via drill 0.6)
  Top 0.254: v34.6,65.41 IC14.5 | v17.3,64.94 17.93,65.57 23.17,65.57 23.49,65.25 25.71,65.25 26.03,65.57 34.44,65.57
  Top 0.305: 34.44,65.57 v34.6,65.41
  Bottom 0.305: RN2.9 35.55,10.17 32.86,12.87 32.86,21.91 33.17,22.23 33.17,23.82 32.86,24.14 32.86,38.27 33.17,38.58 33.17,39.69 32.86,40.17 32.86,56.2 33.49,56.84 33.49,59.06 32.86,59.7 32.86,63.67 v34.6,65.41 | P1.A23 6.82,66.52 8.09,65.25 16.98,65.25 v17.3,64.94
/BRES  (via drill 0.6)
  Top 0.406: v33.73,77.4 33.73,77.32 35,76.05 v40.16,76.05 v48.33,76.05 | v49.68,63.98 49.92,63.98 50.08,64.14 IC18.6
  Bottom 0.254: 41.11,13.02 41.11,45.89 41.91,46.68 41.91,58.43
  Bottom 0.305: RN2.6 43.18,10.96 41.11,13.02 | 41.91,58.43 39.52,60.81 39.52,69.06 40,69.54 40,70.02 40.64,70.65 40.64,72.08 39.68,73.03 39.68,75.57 v40.16,76.05
  Bottom 0.406: P1.A27 6.82,76.68 8.09,77.95 11.58,77.95 13.41,79.78 18.89,79.78 20.71,77.95 31.59,77.95 32.14,77.4 v33.73,77.4 | v48.33,76.05 48.26,64.78 49.45,64.14 v49.68,63.98
/FPGA_BOOT
  Top 0.254: IC7.9 125.25,34.14 125.25,25.25 115.72,25.25 115.41,24.93 115.41,23.34 U$18.1
/FRAMSEL  (via drill 0.6)
  Top 0.254: 48.41,42.08 v48.73,41.76 | 51.75,61.2 52.22,61.2 52.62,61.6 54.45,61.6 54.84,61.2 65.96,61.2 67.17,62.14 67.19,62.16 67.27,62.15 U$2.120
  Top 0.305: IC1.24 41.27,39.54 40.64,38.9 35.87,38.9 35.4,39.38 33.33,39.38 32.86,40.17 32.86,42.08 33.49,42.71 34.6,42.71 35.24,42.08 IC1.22 48.41,42.08 | v50.16,61.2 51.75,61.2
  Bottom 0.254: 48.73,51.28 50.24,52.87 50.24,59.38 50.16,59.54 v50.16,61.2
  Bottom 0.305: v48.73,41.76 48.73,51.28
/IOSEL  (via drill 0.6)
  Top 0.254: IC13.6 25.55,67.48 26.19,66.84 v32.38,66.84 | v32.06,57.79 33.49,57.79 34.13,58.51 47.22,58.51 50.08,56.2 51.75,56.05 61.99,56.05 62.15,56.28 68.42,56.28 69.55,55.15 U$2.134
  Bottom 0.305: v32.06,57.79 32.06,58.59 32.38,58.9 v32.38,66.84
/IRQ  (via drill 0.6)
  Top 0.254: IC18.2 v54.84,69.22 | v54.37,75.17 56.35,77.16 v62.46,77.16 | v88.42,12.07 88.26,12.23 88.26,17.63 89.45,18.82 U$1.5 89.45,20.09 88.42,21.12 88.42,29.06 85.4,30.49 85.4,37.63 85.24,39.14 85.24,40.88 85.64,41.76 85.64,43.9 85.4,44.93 85.4,46.36 85.43,46.71 U$2.23 | JP11.1 v56.43,11.99
  Top 0.305: v113.02,81.45 113.02,81.92 112.55,82.4 112.55,83.35 108.98,86.84 108.98,90.02 109.69,91.29 110.17,91.29 112.39,93.51 v112.39,96.21
  Bottom 0.254: 55.88,28.9 55.88,54.93 55.64,55.25 55.64,63.74 56.51,64.62 56.51,66.52 54.92,68.11 54.92,69.14 v54.84,69.22 54.84,70.25 54.37,70.73 v54.37,75.17 | 58.57,10.17 68.42,10.17 70.32,12.07 v88.42,12.07 | D5.A 122.47,76.84 R9.2 | v56.43,11.99 56.35,11.99 56.35,12.39
  Bottom 0.305: v62.46,77.16 62.46,81.21 63.42,82.16 63.42,89.22 64.13,89.94 65.64,89.94 66.43,90.65 71.43,90.65 73.58,96.69 83.02,96.69 84.13,97.8 84.21,97.8 85.64,98.83 106.12,98.83 106.99,98.35 110.01,98.43 111.6,97 v112.39,96.21 | v113.02,81.45 114.14,80.33 117.31,80.33 117.95,80.65 122.47,80.65 | 122.47,80.65 D6.A | 122.47,80.65 D5.A | 55.88,28.9 56.51,28.26 56.51,22.71 56.03,22.23 55.88,22.23 56.35,20.96 56.35,12.39 58.57,10.17
/LDAC  (via drill 0.6)
  Top 0.254: v52.78,54.14 53.41,54.06 61.27,54.06 61.75,53.58 68.26,53.58 68.77,53.15 U$2.138 | v51.67,26.12 53.73,26.12 54.37,25.49 59.29,25.49 59.69,25.09 62.07,25.09 62.7,24.45 64.92,24.45 65.56,25.09 v66.51,25.09 | v103.26,18.58 104.77,18.58 106.36,20.17 SN1.5
  Bottom 0.254: v52.78,54.14 52.78,52.95 52.54,52.71 52.54,49.06 53.34,48.27 53.34,33.9 50.8,31.36 50.8,28.18 51.59,27.39 51.59,26.2 v51.67,26.12 | v66.51,25.09 67.94,25.09 68.02,25.01 73.81,25.01 75.16,23.42 97.86,23.42 98.1,23.74 98.66,23.74 101.75,26.84 102.86,26.84 103.26,26.44 v103.26,18.58
/MEMSEL  (via drill 0.6)
  Top 0.254: IC13.4 23.65,70.02 24.28,70.65 34.76,70.65 | U$2.112 65.45,66.15 64.29,66.84 v62.86,66.84
  Top 0.305: 34.76,70.65 35.4,71.29 38.41,71.29 39.21,72.08 40.48,72.08 42.22,73.83 54.68,73.83 55.24,74.38 v62.3,74.3
  Bottom 0.254: v62.86,66.84 62.86,68.03 62.7,68.19 62.7,73.98 v62.3,74.3
/NMI  (via drill 0.6)
  Top 0.254: U$1.7 94.53,17.23 93.66,16.36 v93.66,11.44 | R11.2 86.51,7.31 88.1,5.72 JP7.4
  Top 0.305: IC18.4 v54.61,66.68
  Bottom 0.254: 54.45,66.68 53.97,66.05 53.97,61.68 54.13,61.13 54.13,55.33 54.92,54.46 54.92,27.95 | v93.66,11.44 88.02,10.96 R11.2 85.01,11.12 70.96,11.12 69.05,9.21 57.62,9.21
  Bottom 0.305: v54.61,66.68 54.45,66.68 | 54.92,27.95 54.76,26.99 54.76,22.87 54.92,21.91 55.4,20.64 55.4,11.2 57.62,9.21
/RAMCS  (via drill 0.6)
  Top 0.254: IC10.22 119.14,61.76 119.33,61.96 | 119.33,61.96 119.53,62.16 119.53,63.82 118.98,64.3 IC10.24 113.82,64.3 113.18,63.67 101.12,63.67 99.03,61.57 95.72,61.6 94.8,61.15 U$2.59 | v119.53,60.97 119.53,61.76 119.33,61.96
/RAMWE
  Top 0.254: IC10.29 113.98,70.65 113.34,71.29 102.23,71.29 100.32,73.43 87.86,73.43 87.77,72.38 87.67,72.12 87.43,71.57 U$2.82
/RES  (via drill 0.6)
  Top 0.254: 60.96,64.14 62.54,64.14 63.19,63.34 64.61,63.35 65.07,63.81 v65.88,63.81 v65.88,63.82 66.05,63.65 U$2.117 | 60.96,64.14 IC18.9 | v60.72,63.19 60.72,63.98 60.96,64.14 | 84.37,13.02 U$1.44 83.1,18.1 83.1,20.01 83.74,20.64 v83.74,24.22 | 84.37,13.02 84.37,11.83 85.4,10.8 v85.4,6.67 | v83.18,13.02 84.37,13.02 | v107.15,80.65 107.15,82 106.04,83.03 66.35,83.03 v65.88,83.51 | IC3.8 107.55,34.14 106.91,34.77 102.63,34.77 100.96,33.42 v100.96,28.66
  Top 0.305: S1.2 157.75,87.12 156.84,86.21 150.92,86.17 144.93,80.18 142.71,80.18 | 142.71,80.18 129.69,80.18 128.74,79.22 120.33,79.22 v119.85,79.7 | IC8.12 135.4,60.66 v135.41,60.81 | D8.C 143.03,62.4 143.66,63.03 143.66,70.49 143.19,70.97 143.19,73.83 142.87,74.14 142.87,80.02 142.71,80.18
  Bottom 0.254: 58.89,61.2 58.89,61.28 v60.72,63.19 | v85.4,6.67 83.5,6.67 JP7.1 80,3.66 77.78,5.88 74.53,5.88 DS1818.1 | 58.89,11.44 68.26,11.44 69.92,13.1 v83.18,13.02 | 110.8,80.02 108.34,80.02 107.71,80.65 v107.15,80.65 | v65.88,83.51 65.88,78.35 66.99,77.24 66.99,75.57 65.88,74.46 v65.88,63.82 | v100.96,28.66 100.72,28.66 97.86,25.8 91.44,25.8 90.64,25.01 84.53,25.01 v83.74,24.22
  Bottom 0.305: 110.8,80.02 111.28,80.49 112.55,80.49 113.82,79.7 v119.85,79.7 | 58.89,61.2 58.89,52.79 57.22,51.28 56.67,50.73 56.67,33.9 57.07,33.5 57.07,22.71 57.3,21.28 57.3,13.02 58.89,11.44 | v135.41,60.81 135.88,60.81 136.04,60.65 141.6,60.65 D8.C
/USBINT  (via drill 0.6)
  Top 0.305: D5.C 127.95,77.95 128.66,77.24 128.58,77.16 128.58,72.56 127.63,71.6 127.63,66.21 129.22,64.62 129.22,63.67 128.58,63.03 v128.58,61.76 | IC8.18 138.29,64.32 137.95,63.98 137.95,63.35 138.58,62.71 v138.58,61.76
  Bottom 0.305: v138.58,61.76 v128.58,61.76
A0  (via drill 0.5, 0.6)
  Top 0.254: IC1.12 57.86,43.35 58.18,43.66 58.57,43.66 | v35.4,70.02 IC13.17 | U$1.10 91.99,22.15 90.96,23.1 90.96,35.49 91.04,36.04 91.04,40.33 91.51,40.81 v91.51,43.9 | v83.66,43.03 83.18,43.19 83.18,46.52 82.43,47.35 U$2.17
  Top 0.305: 58.57,43.66 v59.69,43.66 | IC1.12 51.11,43.35 50.48,43.98 37.62,43.98 v36.83,44.3
  Bottom 0.254: v91.51,43.9 90.96,44.62 87.78,44.62 86.2,43.03 v83.66,43.03 82.07,43.03 81.83,43.27 80.96,43.27 80.88,43.35 78.73,43.35 77.94,44.69 73.73,44.69 73.26,45.01 62.7,44.93 62.62,44.46 62.07,44.46 60.16,43.66
  Bottom 0.305: v59.69,43.66 60.16,43.66 | v36.83,44.3 36.83,56.05 36.35,56.52 36.35,67 35.4,67.95 v35.4,70.02
A1  (via drill 0.6)
  Top 0.254: IC1.11 57.7,42.08 58.02,41.84 59.13,41.84 59.53,42.23 60.4,42.23 60.48,42.31 60.64,42.39 v61.51,42.87 | v35.24,66.84 33.97,66.84 33.17,67.79 31.74,67.79 31.43,67.48 IC13.15 | U$1.11 95.96,24.45 98.26,26.76 98.26,38.98 99.61,39.61 100.25,41.76 | v97.23,59.7 97.19,59.65 96.48,59.65 96.2,59.7 96.07,59.65 U$2.56 | v99.61,44.14 100.25,41.76 | v100.25,41.84 100.25,41.76
  Top 0.305: IC1.11 50.48,42.08 49.84,42.71 36.19,42.71 35.87,43.03 v35.55,43.03
  Bottom 0.254: v97.23,59.7 99.05,58.11 99.21,56.92 100.72,55.57 100.8,53.98 100.8,48.74 100.64,48.03 100.64,46.04 99.69,45.09 v99.61,44.14 | v61.51,42.87 62.94,42.87 63.5,42.23 65.72,42.23 66.51,43.19 74.69,43.19 75.64,42.47 76.91,42.39 77.62,41.68 85.16,41.68 85.48,42 92.31,42 92.86,41.6 99.85,41.6 v100.25,41.84
  Bottom 0.305: v35.55,43.03 35.55,44.46 35.87,44.77 35.87,66.21 v35.24,66.84
A2  (via drill 0.6)
  Top 0.254: IC1.10 59.53,40.81 60.16,41.2 61.51,41.2 v61.59,41.12 | v34.6,63.82 33.02,64.94 IC13.13 | U$1.13 96.12,26.99 97.78,28.66 97.78,39.54 98.58,39.93 98.56,40.5 | 98.56,40.5 v98.58,43.42 | v97.78,40.33 98.39,40.33 98.56,40.5 | U$2.45 96.69,54.15 v98.18,55.49
  Top 0.305: IC1.10 54.21,40.81 53.49,40.09 50.64,40.09 49.92,40.81 46.51,40.81 45.87,41.44 v34.44,41.44 | 28.89,64.94 IC13.13
  Bottom 0.254: v98.58,43.42 98.58,44.77 100.09,46.28 100.09,48.19 100.25,48.74 100.25,55.17 99.93,55.65 v98.18,55.49 | v61.59,41.12 61.99,40.81 63.18,40.81 63.57,41.12 65.96,41.12 66.43,41.6 66.67,41.92 66.99,42.23 74.29,42.23 75.08,41.44 76.35,41.44 77.07,40.73 85.72,40.73 86.12,41.04 91.67,41.04 92.86,40.01 97.47,40.01 v97.78,40.33
  Bottom 0.305: v34.44,41.44 34.44,44.62 34.92,45.09 34.92,63.03 v34.6,63.82
A3  (via drill 0.6)
  Top 0.254: IC1.9 58.26,39.54 58.34,39.46 59.29,39.46 59.37,39.54 59.84,39.54 v60.48,39.14 | IC13.11 33.49,62.4 v33.81,62.55 | U$1.14 91.99,27.31 93.26,28.58 93.26,30.17 93.82,30.72 95.32,30.72 96.12,31.52 96.12,41.44 96.36,41.68 v96.36,43.35 | v98.82,53.51 97.23,53.11 96.15,53.15 U$2.43
  Top 0.305: IC1.9 54.61,39.54 53.97,38.9 50.08,38.9 49.45,39.54 45.87,39.54 45.24,40.17 41.11,40.17 40.48,39.54 36.19,39.54 35.55,40.17 33.97,40.17 v33.81,40.33
  Bottom 0.254: v98.82,53.51 98.98,53.51 99.13,52.87 99.13,49.62 98.9,48.66 98.9,46.92 98.98,46.84 97.47,45.81 96.36,44.69 v96.36,43.35 | v60.48,39.14 60,39.14 59.76,39.38 58.73,39.38 58.41,39.06 58.41,35.01 59.29,34.14 59.29,30.09 61.19,28.11 90.88,28.03 U$1.14
  Bottom 0.305: v33.81,40.33 33.49,40.65 33.49,44.62 34.13,45.25 34.13,61.6 33.81,62.08 v33.81,62.55
A4  (via drill 0.6)
  Top 0.254: 32.06,38.27 32.86,38.9 | U$1.15 96.04,29.53 97.07,30.57 97.15,38.27 96.67,38.74 96.67,41.12 97.47,41.92 v97.47,44.14 | U$2.44 96.82,53.65 v99.37,54.78
  Top 0.305: IC4.18 32.06,38.27 | 32.86,38.9 34.92,38.9 35.55,38.27 40.79,38.27 41.43,38.9 49.21,38.9 49.84,38.27 IC1.8 58.1,38.27 58.41,38.58 v59.21,38.58
  Bottom 0.254: v97.47,44.14 97.78,44.77 99.53,46.68 99.53,48.5 99.61,48.74 99.69,48.82 99.69,54.06 99.61,54.85 v99.37,54.78 | v59.21,38.58 59.21,35.01 59.84,34.46 59.84,30.33 61.59,28.58 75.4,28.58 76.04,28.5 93.42,28.5 U$1.15
A5  (via drill 0.5, 0.6)
  Top 0.254: U$1.16 91.99,30.01 93.1,31.12 93.1,32.55 94.45,34.22 v94.45,37.55 94.45,42.31 94.37,43.66 v94.37,44.62 | v96.75,51.68 95.27,51.65 U$2.40
  Top 0.305: IC4.17 32.86,37 33.49,37.63 34.29,37.63 34.92,37 41.11,37 41.75,37.63 48.65,37.63 49.29,37 IC1.7 60.8,37 61.43,37.47 v61.51,37.47
  Bottom 0.254: v94.37,44.62 94.37,46.36 94.77,47.87 96.75,48.98 v96.75,51.68 | v61.51,37.47 63.34,37.47 63.65,37.39 67.86,37.39 68.81,38.11 72.62,38.11 73.58,37.15 76.51,37.15 77.46,38.11 78.02,38.11 78.5,37.79 80.88,37.79 81.2,37.47 84.29,37.47 84.69,37.07 93.66,37.07 94.05,37.47 94.13,37.47 v94.45,37.55
A6  (via drill 0.6)
  Top 0.254: v98.26,52.39 98.1,52.47 98.02,52.55 96.04,52.55 95.73,52.4 95.56,52.24 95.17,52.15 U$2.41 | v95.48,44.22 95.48,33.03 U$1.17 | IC1.6 64.77,35.73 65.08,35.25 65.08,32.15 65.72,31.52 v65.72,30.57
  Top 0.305: IC4.16 41.43,35.73 42.06,36.36 48.26,36.36 48.89,35.73 IC1.6
  Bottom 0.254: v98.26,52.39 98.34,52.47 98.42,52.16 98.42,47.31 98.34,47.23 96.91,46.28 95.88,45.25 v95.48,44.22 | v65.72,30.57 68.5,30.88 69.37,30.57 93.26,30.57 U$1.17
A7  (via drill 0.5, 0.6)
  Top 0.254: U$1.18 v91.99,39.54 | v86.64,40.2 86.67,40.25 86.67,40.17 86.83,40.65 86.83,44.3 86.35,45.25 86.35,46.04 86.67,46.52 86.67,46.68 86.93,46.94 U$2.26 | v66.83,40.33 66.83,37.79 66.67,37.23 v66.67,35.65
  Top 0.305: IC4.15 41.75,34.46 42.38,35.09 47.78,35.09 48.41,34.46 IC1.5 62.78,34.46 63.1,34.14 v63.18,34.14
  Bottom 0.254: v91.99,39.54 91.36,39.85 87.47,39.85 v86.64,40.2 86.2,40.25 76.91,40.25 76.91,40.17 76.27,39.54 75.96,39.54 74.61,40.41 73.89,41.12 70.4,41.12 69.71,40.28 67.44,40.28 v66.83,40.33 | v63.18,34.14 63.42,34.38 v66.67,35.65
A8  (via drill 0.5, 0.6)
  Top 0.254: U$1.19 93.18,33.66 93.18,41.12 92.94,41.36 v92.94,42.63 | v88.34,42.95 88.43,44.76 88.93,45.26 U$2.30 | 60.32,35.09 63.73,35.09 64.45,34.38 v64.45,31.04
  Top 0.305: IC4.14 28.09,33.19 27.62,33.66 27.62,34.61 28.09,35.09 41.59,35.09 42.22,35.73 IC1.27 48.02,35.73 48.65,35.09 60.32,35.09
  Bottom 0.254: v88.34,42.95 v92.94,42.63 | v64.45,31.04 64.77,31.12 65.16,31.36 68.5,31.36 69.37,31.04 91.04,31.04 U$1.19
A9  (via drill 0.6)
  Top 0.254: U$1.20 v89.45,38.42 | v79.21,38.82 79.25,38.86 79.37,44.3 79.45,44.77 79.45,45.89 78.93,46.48 U$2.10 | 60.64,36.36 61.91,36.36 62.46,36.92 v62.46,38.66
  Top 0.305: 60.64,36.36 49.05,36.36 48.41,37 IC1.26 41.91,37 41.27,36.36 34.29,36.36 v33.81,36.68 | IC4.13 v33.81,31.92
  Bottom 0.254: v89.45,38.42 83.58,38.42 83.26,38.82 82.86,39.22 80.08,39.22 79.69,38.82 v79.21,38.82 77.31,38.82 76.83,38.34 76.04,38.34 75.56,37.63 73.81,37.63 72.86,38.58 68.18,38.58 67.38,37.87 63.81,37.87 63.26,38.66 v62.46,38.66
  Bottom 0.305: v33.81,31.92 v33.81,36.68
A10  (via drill 0.5, 0.6)
  Top 0.254: IC1.23 45.56,40.81 | U$1.21 89.45,32.23 90.48,33.26 90.48,42.08 90.24,42.63 v90.24,43.74 | v80.25,42.56 80.16,43.03 79.93,43.19 79.93,46.04 79.45,46.6 79.45,47.16 79.43,47.17 U$2.11 | v65.16,43.66 v65.64,40.33
  Top 0.305: 45.56,40.81 46.19,40.17 49.68,40.17 50.32,39.54 53.73,39.54 54.37,40.17 60,40.17 v60.64,40.33 | IC1.23 38.73,40.81 38.41,40.49 v37.78,40.49 | v34.92,30.65 IC4.12
  Bottom 0.254: v90.24,43.74 89.85,43.82 87.78,43.82 86.51,42.55 85.32,42.55 85.01,42.23 80.8,42.23 80.64,42.39 80.64,42.47 v80.25,42.56 79.93,42.56 79.85,42.31 78.57,42.32 77.54,44.22 73.5,44.22 73.1,44.54 66.59,44.46 66.11,44.46 65.87,44.21 65.72,44.06 v65.16,43.66 | v65.64,40.33 v60.64,40.33
  Bottom 0.305: v37.78,40.49 37.7,40.33 34.92,37.55 v34.92,30.65
A11  (via drill 0.6)
  Top 0.254: v71.75,36.84 71.43,37.15 v71.51,39.93 71.27,45.17 69.37,47.47 69.21,50.49 69.58,51.02 69.71,51.15 U$2.142 | 61.27,38.58 61.99,39.54 v63.26,39.54
  Top 0.305: 61.27,38.58 60.32,37.63 49.53,37.63 48.89,38.27 IC1.25 41.59,38.27 40.95,37.63 35.24,37.63 34.6,38.27 33.17,38.27 32.54,37.63 28.25,37.63 27.14,36.52 27.14,30.96 28.73,29.38 IC4.11
  Bottom 0.254: U$1.22 86.91,35.65 81.43,35.65 80.96,36.12 72.31,36.12 71.83,36.84 v71.75,36.84 | v63.26,39.54 69.77,39.54 70.16,39.93 v71.51,39.93
A12  (via drill 0.6)
  Top 0.254: v66.03,47.71 69.53,44.46 69.53,40.81 68.97,40.25 68.97,34.69 v68.81,34.3 69.45,33.42 v69.45,31.92 | v65.4,59.14 67.26,59.18 67.34,59.18 68.02,58.66 68.48,58.65 U$2.127 | IC1.4 60.48,33.11 60.72,33.11 61.99,32.07 v62.46,31.76
  Top 0.305: IC5.18 v49.45,21.6 | v49.05,32.87 51.43,33.19 IC1.4
  Bottom 0.254: U$1.25 84.37,32.55 83.26,33.58 71.67,33.58 71.59,33.66 70.88,33.66 70,33.98 68.89,34.14 v68.81,34.3 | v66.03,47.71 65.4,48.43 65.24,48.58 65.24,58.03 v65.4,59.14 | v62.46,31.76 62.46,31.92 v69.45,31.92
  Bottom 0.305: v49.45,21.6 49.45,26.36 49.05,26.99 v49.05,32.87
A13  (via drill 0.6)
  Top 0.254: v67.62,48.82 67.62,47.95 70.64,44.93 70.64,44.69 70.72,40.25 70.08,39.61 70.08,37.07 v70.32,36.68 71.27,35.41 71.19,32.47 v71.35,31.92 | v67.62,52.63 68.59,52.64 69.93,52.65 U$2.139
  Top 0.305: v62.07,33.42 61.59,33.42 60.8,33.82 48.18,33.82 47.54,34.46 IC1.28 42.54,34.46 42.38,34.3 41.27,32.87 v35.87,32.87 | IC5.17 v35.87,20.33
  Bottom 0.254: U$1.26 81.83,34.77 80.72,35.65 71.51,35.65 v70.32,36.68 | v67.62,48.82 v67.62,52.63 | 62.78,32.71 69.77,32.71 v71.35,31.92
  Bottom 0.305: v35.87,20.33 v35.87,32.87 | v62.07,33.42 62.78,32.71
A14  (via drill 0.6)
  Top 0.254: v64.61,48.11 64.61,47.71 66.11,46.2 68.97,44.22 68.97,40.88 68.42,40.33 68.42,35.17 67.7,34.46 v67.7,33.66 67.7,30.96 67.78,30.88 68.42,30.41 v68.34,30.01 | v64.53,61.99 65.16,61.99 65.4,62.24 66.35,62.24 66.83,62.71 70.8,62.71 70.86,62.65 U$2.119
  Top 0.305: IC5.16 v50.8,19.06 | v51.59,29.38 54.61,31.76 56.42,31.76 IC1.3 59.53,31.92 v61.11,30.49
  Bottom 0.254: U$1.27 81.83,32.15 80.8,33.11 70.48,33.11 70.4,33.19 68.89,33.19 67.94,33.5 v67.7,33.66 | v64.61,48.11 v64.53,61.99 | v61.11,30.49 63.65,30.49 64.45,29.77 66.67,29.77 66.99,30.01 v68.34,30.01
  Bottom 0.305: v50.8,19.06 52.07,20.8 52.62,21.36 52.62,26.84 52.07,27.39 52.07,27.79 51.59,28.26 v51.59,29.38
A15  (via drill 0.6)
  Top 0.254: v61.11,18.5 60.8,17.79 | 70.16,34.69 70.32,34.53 70.4,34.3 v70.4,21.91 | 70.16,34.69 69.45,35.41 69.45,40.01 70.16,40.57 70.16,44.62 67.07,47.71 v66.35,48.98 | v70.24,34.85 70.16,34.69 | U$2.131 70.51,56.65 69.37,57.79 66.83,57.79 v66.35,58.27
  Top 0.305: IC5.15 60.8,17.79
  Bottom 0.254: U$1.28 78.58,34.61 78.02,34.06 72.07,34.06 v70.24,34.85 | v66.35,48.98 v66.35,58.27 | 63.1,21.76 70.24,21.76 v70.4,21.91
  Bottom 0.305: v61.11,18.5 61.03,18.66 60.96,20.01 63.1,21.76
ABORTB  (via drill 0.6)
  Top 0.254: R10.2 80.8,7.79 81.12,7.47 | 81.12,7.47 83.02,5.56 JP7.2 | U$1.4 89.45,13.1 90.96,11.6 v90.96,7.79 | v81.75,7.79 81.43,7.79 81.12,7.47
  Bottom 0.254: v90.96,7.79 v81.75,7.79
B2PHI2
  Top 0.305: P1.C29 12.38,81.76 14.44,83.67 22.86,83.67 23.49,83.03 IC19.14
B8PHI2
  Top 0.305: P1.C31 13.49,86.84 15.55,88.75 23.49,88.75 24.12,88.11 IC19.18
B16M
  Top 0.305: P1.C30 12.7,84.3 14.76,86.21 23.33,86.21 23.97,85.57 IC19.16
BA0
  Top 0.254: P1.C23 12.85,66.52 17.62,71.29 IC13.3
BA1
  Top 0.254: P1.C22 12.22,63.98 16.98,68.75 IC13.5
BA2
  Top 0.254: P1.C21 12.38,61.44 17.14,66.21 IC13.7
BA3
  Top 0.254: P1.C20 12.38,58.9 17.14,63.67 IC13.9
BA4  (via drill 0.6)
  Top 0.305: 18.41,39.54 IC4.2
  Top 0.406: v17.3,46.04 17.3,40.65 18.41,39.54
  Bottom 0.406: P1.C19 10.95,56.36 16.19,51.12 16.19,48.43 17.3,47.31 v17.3,46.04
BA5  (via drill 0.6)
  Top 0.305: 16.35,40.65 18.57,38.27 IC4.3
  Top 0.406: v16.35,45.25 16.35,40.65
  Bottom 0.406: P1.C18 11.11,53.82 15.55,49.38 15.55,48.11 16.19,47.47 v16.35,45.25
BA6  (via drill 0.6)
  Top 0.305: 15.39,40.17 18.57,37 IC4.4
  Top 0.406: v15.24,46.2 15.39,46.04 15.39,40.17
  Bottom 0.406: P1.C17 11.11,51.28 15.24,47.16 v15.24,46.2
BA7  (via drill 0.6)
  Top 0.305: 14.44,40.01 18.73,35.73 IC4.5
  Top 0.406: v14.44,45.09 14.44,40.01
  Bottom 0.406: P1.C16 10.79,48.74 v14.44,45.09
BA8  (via drill 0.6)
  Top 0.254: 13.49,43.19 13.49,39.85
  Top 0.305: 13.49,39.85 18.89,34.46 IC4.6
  Top 0.406: v13.33,43.5 13.33,43.35 13.49,43.19
  Bottom 0.254: P1.C15 v13.33,43.5
BA9
  Top 0.254: P1.C14 12.85,41.44 12.85,39.22
  Top 0.305: 12.85,39.22 18.89,33.19 IC4.7
BA10
  Top 0.254: P1.C13 10.79,41.12 12.06,39.85 12.06,38.74
  Top 0.305: 12.06,38.74 18.89,31.92 IC4.8
BA11
  Top 0.254: P1.C12 11.43,38.27
  Top 0.305: 11.43,38.27 19.04,30.8 IC4.9
BA12
  Top 0.305: P1.C11 17.62,29.06 17.62,23.5 18.25,22.87 IC5.2
BA13
  Top 0.305: 10.79,33.5 16.66,27.63 16.66,22.55 17.62,21.6 IC5.3
  Top 0.406: P1.C10 10.79,33.5
BA14
  Top 0.305: P1.C9 11.43,30.96 15.87,26.52 15.87,22.07 17.62,20.33 IC5.4
BA15
  Top 0.305: P1.C8 11.58,28.42 14.92,25.09 14.92,21.76 17.62,19.06 IC5.5
BA16
  Top 0.305: 11.58,25.88 14.12,23.34 14.12,21.28 17.62,17.79 IC5.6
  Top 0.406: P1.C7 11.58,25.88
BA17
  Top 0.305: 11.27,23.34 13.17,21.44 13.17,21.12 17.77,16.52 IC5.7
  Top 0.406: P1.C6 11.27,23.34
BA18
  Top 0.305: P1.C5 12.38,20.8 17.93,15.25 IC5.8
BA19
  Top 0.305: P1.C4 11.9,18.26 16.19,13.98 IC5.9
BD0  (via drill 0.6)
  Top 0.254: IC16.3 17.62,56.84
  Top 0.305: 17.62,56.84 v15.24,59.22
  Bottom 0.254: P1.A22 6.82,63.98 8.09,62.71 11.74,62.71 v15.24,59.22
BD1  (via drill 0.6)
  Top 0.305: IC16.4 16.5,55.57 v14.12,57.95
  Bottom 0.254: P1.A21 6.82,61.44 8.09,60.17 11.9,60.17 v14.12,57.95
BD2
  Top 0.305: P1.A20 6.82,58.9 8.09,57.63 11.58,57.63 14.92,54.3 IC16.5
BD3
  Top 0.305: P1.A19 6.98,56.36 8.25,55.09 12.06,55.09 14.12,53.03 IC16.6
BD4
  Top 0.305: P1.A18 6.98,53.82 8.25,52.55 12.54,52.55 13.33,51.76 IC16.7
BD5
  Top 0.305: P1.A17 6.98,51.28 8.25,50.01 13.49,50.01 13.97,50.49 IC16.8
BD6
  Top 0.305: P1.A16 6.98,48.74 8.25,47.47 13.17,47.47 13.85,48.15 | 13.85,48.15 14.12,48.43 | IC16.9 14.92,49.22 13.85,48.15
BD7
  Top 0.305: P1.A15 6.98,46.2 8.25,44.93 12.38,44.93 14.6,47.16 15.39,47.95 IC16.10
BE  (via drill 0.6)
  Top 0.254: IC6.4 v65.95,17.47 v65.96,17.47
  Bottom 0.254: v65.96,17.47 76.35,17.47 76.99,16.83 U$1.40
BE_IN  (via drill 0.6)
  Top 0.254: IC14.8 48.73,62.87 49.53,62.08 62.46,62.08 63.59,62.81 66.27,62.87 66.67,63.19 71.04,63.19 71.15,63.15 U$2.118 | IC13.1 23.33,73.83 v23.97,74.46 | v26.27,55.09 26.66,55.09 27.78,56.2 30.63,56.2 31.11,55.81 36.51,55.73 v46.98,55.73
  Top 0.305: v48.1,61.76 48.1,62.45 IC14.8
  Bottom 0.305: v23.97,74.46 24.92,74.46 26.03,73.35 26.03,71.13 26.35,70.81 26.35,62.87 25.87,62.4 25.87,59.86 25.55,59.54 25.55,56.05 v26.27,55.09 | v46.98,55.73 46.98,60.33 v48.1,61.76
BLUE  (via drill 0.5, 0.6)
  Top 0.254: IC2.16 120.49,20.17 v119.14,21.83
  Top 0.305: IC2.16 120.49,16.68 121.28,15.88 121.28,14.45 120.96,14.14 120.96,11.28 120.8,11.12 120.8,10.48 121.12,10.17 v121.12,5.4
  Bottom 0.254: v119.14,21.83 119.14,28.42 119.69,29.06 125.49,29.06 128.58,32.15 136.28,32.15 136.76,31.68 D4.A
  Bottom 0.305: v121.12,5.4 122.71,5.4 123.03,5.09 134.85,5.09 135.41,6.67 v135.41,7.31 | 136.84,29.85 D4.A
BOUT  (via drill 0.5, 0.6)
  Top 0.254: IC2.4 119.22,10.64 119.06,10.8 119.06,12.23 v119.38,12.55 | U$2.94 81.43,71.2 v82.7,72.48
  Bottom 0.254: v82.7,72.48 82.7,72.79 82.47,73.03 82.47,74.86 82.86,77.16 107.47,77.16 107.47,47.87 107.79,47.55 107.79,47 109.69,45.09 109.69,33.66 108.02,31.99 108.1,19.29 112.31,14.69 114.53,12.55 v119.38,12.55
BPHI2
  Top 0.305: P1.C28 12.38,79.22 14.44,81.13 22.86,81.13 23.49,80.49 IC19.12
  Top 0.406: P1.C26 11.27,74.14 12.7,75.57 12.7,77.16 P1.C28
BR/-W  (via drill 0.6)
  Top 0.254: P1.C25 13.65,71.6 15.08,73.03 15.24,73.03 15.39,73.19 24.12,73.19 | v24.44,64.14 24.6,64.14 25.08,63.67 IC13.12
  Top 0.305: 24.12,73.19 v24.44,73.35
  Bottom 0.305: v24.44,73.35 23.81,73.03 23.81,68.59 23.01,67.79 23.01,66.52 24.44,65.41 v24.44,64.14
BRDY  (via drill 0.6)
  Top 0.406: v20.55,75.33 22.86,75.33 23.01,75.49 26.43,75.49 26.59,75.33 v30.24,75.33 | v39.6,71.21 40.32,70.49 IC14.1
  Bottom 0.254: RN2.7 40.64,46.04 41.43,46.84 41.43,57.95
  Bottom 0.305: 41.43,57.95 38.57,60.81 38.57,66.21 39.05,66.68 39.05,70.65 v39.6,71.21
  Bottom 0.406: P1.A26 6.98,74.14 8.25,75.41 11.43,75.41 13.73,73.83 17.85,73.83 20.08,74.7 20.71,75.33 20.55,75.25 v20.55,75.33 | v30.24,75.33 30.79,75.1 39.05,75.1 39.05,71.6 v39.6,71.21
BSYNC
  Top 0.254: P1.C24 12.38,69.06 15.24,71.92 24.12,71.92 24.76,71.29 IC13.18
BV33  (via drill 0.6)
  Top 0.61: v3.49,72.87 13.25,72.87 15.39,75.02 JP6.2
  Top 0.813: P1.A9 3.57,30.96 2.61,31.92 2.61,72.87 v3.49,72.87
C2PHI2  (via drill 0.6)
  Top 0.254: 53.18,80.65 63.97,80.65 v64.77,80.41 | v64.77,75.41 65.48,75.41 65.88,75.81 73.34,75.81 76.22,72.84 76.22,71.57 76.43,70.73 U$2.104
  Top 0.305: 53.18,80.65 50.56,77.71 50.48,77.64 37.46,77.64 31.74,83.03 31.11,83.67 23.81,83.67 23.17,84.3 IC19.6
  Bottom 0.254: v64.77,80.41 64.77,78.59 64.37,78.19 64.37,77 64.77,76.68 v64.77,75.41
C8PHI2  (via drill 0.6)
  Top 0.254: v56.91,76.05 57.22,76.6 61.51,76.6 61.67,76.37 73.5,76.37 76.72,73.22 76.72,71.55 76.83,71.29 77.07,71.13 77.43,70.45 U$2.102
  Top 0.305: v53.02,83.51 36.98,83.51 31.74,88.75 24.44,88.75 23.81,89.38 IC19.2
  Bottom 0.254: 53.02,79.38 53.02,78.27 53.49,77.79 55.72,77.79 v56.91,76.05
  Bottom 0.305: v53.02,83.51 53.02,79.38
CPHI2  (via drill 0.6)
  Top 0.254: 54.45,79.06 54.76,79.38 v63.81,79.38 | U$2.114 68.2,65.15 67.62,65.73 64.37,65.73 64.21,65.89 v63.89,65.89
  Top 0.305: 54.45,79.06 52.38,77 35.71,77 31.59,81.13 23.97,81.13 23.33,81.76 IC19.8
  Bottom 0.254: v63.81,79.38 63.89,74.94 63.73,74.62 63.73,69.7 64.45,68.82 64.45,66.52 64.13,66.21 v63.89,65.89
D0  (via drill 0.6)
  Top 0.254: IC1.13 57.86,44.62 58.89,45.09 59.69,45.09 60.4,45.73 63.26,45.73 63.73,45.25 63.73,40.49 64.29,39.93 v64.29,38.66 | U$1.36 78.97,24.45 77.78,25.64 75.88,25.64 74.92,26.6 v74.92,38.5 75,43.35 75.27,44.8 75.24,44.83 75.24,46.68 74.93,46.99 U$2.2
  Top 0.305: IC1.13 51.75,44.62 51.11,45.25 38.73,45.25 v38.25,45.57 | IC16.21 30.55,55.57 31.03,55.09 37.94,55.09 v38.25,54.78
  Bottom 0.254: v64.29,38.66 65.96,38.66 66.27,38.98 74.61,39.06 v74.92,38.5
  Bottom 0.305: v38.25,45.57 38.1,45.57 37.78,45.89 37.78,54.14 38.25,54.62 v38.25,54.78
D1  (via drill 0.6)
  Top 0.254: IC1.14 57.86,45.89 59.21,47 v60.64,47 | U$1.35 75.64,24.45 74.37,25.72 74.37,36.76 73.97,37.15 73.97,39.14 74.21,39.38 74.21,43.42 74.45,44.3 74.45,45.65 v74.45,45.96 74.43,45.98 U$2.1
  Top 0.305: IC1.14 52.38,45.89 51.75,46.52 39.84,46.52 v38.73,47.63 | IC16.20 34.84,54.3 35.63,53.51 v38.73,53.51
  Bottom 0.254: v60.64,47 61.11,47 62.38,45.89 v74.45,45.96
  Bottom 0.305: v38.73,47.63 38.25,47.95 38.25,52.87 38.73,53.35 v38.73,53.51
D2  (via drill 0.5, 0.6)
  Top 0.254: IC1.15 57.78,47.16 59.53,48.9 v60.88,48.9 | U$1.34 79.37,26.99 80.8,28.42 80.8,40.41 81.75,41.36 81.75,44.93 81.43,45.17 v81.35,45.65 81.16,46.8 81.16,46.84 80.93,47.38 U$2.14
  Top 0.305: IC1.15 53.02,47.16 52.38,47.79 41.11,47.79 v39.21,49.7 | IC16.19 34.52,53.03 35.16,52.39 39.05,52.39 v39.21,52.24
  Bottom 0.254: v60.88,48.9 61.11,48.9 63.18,46.84 72.31,46.84 73.02,47.79 81.12,47.79 v81.35,45.65
  Bottom 0.305: v39.21,49.7 v39.21,52.24
D3  (via drill 0.6)
  Top 0.254: U$1.33 76.51,26.99 75.56,27.95 75.56,37.63 75.96,38.03 v75.96,40.57 75.96,43.5 75.93,44.67 75.88,44.72 75.88,46.6 76.43,47.15 U$2.5 | 56.35,50.57 60.72,50.57 61.43,49.7 64.77,45.73 65.32,45.09 67.54,42.87 v67.38,41.44
  Top 0.305: 56.35,50.57 55.32,49.62 53.89,48.43 IC1.17 41.91,48.43 39.52,50.97 39.44,51.04 38.17,51.04 37.46,51.76 IC16.18
  Bottom 0.254: v67.38,41.44 68.18,41.44 68.42,41.68 74.05,41.68 75,40.88 v75.96,40.57
D4  (via drill 0.5, 0.6)
  Top 0.254: 57.86,46.52 59.37,47.95 v59.84,47.95 | U$1.32 79.37,29.53 80.32,30.49 80.32,40.65 81.25,41.57 81.27,43.11 80.45,43.77 80.45,46.12 v80.4,46.68 79.93,47.31 U$2.12
  Top 0.305: 57.86,46.52 52.7,46.52 52.07,47.16 IC1.18 40.48,47.16 37.14,50.49 IC16.17
  Bottom 0.254: v59.84,47.95 60.96,47.95 63.02,46.36 72.54,46.36 73.42,47.23 80,47.23 v80.4,46.68
D5  (via drill 0.6)
  Top 0.254: 51.43,45.89 IC1.19 39.21,45.89 36.67,48.43 | 57.86,45.25 59.05,46.04 v59.37,46.04 59.61,46.04 59.76,46.2 63.57,46.2 64.29,45.49 64.29,40.65 64.77,40.17 64.77,39.54 65.24,39.06 v64.77,36.52 | U$1.31 76.83,29.53 77.78,30.41 v77.78,37.15 77.78,39.61 78.26,40.09 78.26,44.54 77.78,45.17 77.46,45.49 77.46,46.2 77.93,46.67 U$2.8
  Top 0.305: 51.43,45.89 52.07,45.25 57.86,45.25 | IC16.16 35.87,49.22 36.67,48.43
  Bottom 0.254: v64.77,36.52 68.42,36.52 68.73,36.84 68.65,36.84 69.77,37.63 72.31,37.63 73.34,36.6 77.23,36.6 v77.78,37.15
D6  (via drill 0.5, 0.6)
  Top 0.254: 57.86,43.98 59.21,44.62 60,44.62 60.32,44.93 v60.8,44.93 | U$1.30 78.26,33.03 78.26,35.8 78.89,36.44 78.89,37.79 78.34,38.34 78.34,38.66 78.33,39.37 78.33,39.44 78.73,39.69 78.73,44.22 78.56,45.57 | 78.56,45.57 78.41,45.9 78.42,46.2 78.43,46.69 U$2.9 | v78.58,45.57 78.56,45.57
  Top 0.305: 57.86,43.98 51.43,43.98 50.8,44.62 IC1.20 37.78,44.62 34.44,47.95 IC16.15
  Bottom 0.254: v60.8,44.93 61.83,44.93 62.46,45.41 73.58,45.49 73.81,45.17 78.58,45.17 v78.58,45.57
D7  (via drill 0.6)
  Top 0.254: 60.16,42.71 60.64,43.5 60.72,43.66 v62.62,43.66 | U$1.29 76.12,32.71 76.12,37.31 76.43,37.63 76.43,38.9 76.75,39.22 76.75,40.81 76.75,42.87 76.51,43.03 v76.91,43.19 76.51,43.58 76.51,46.52 76.93,46.94 U$2.6
  Top 0.305: 60.16,42.71 50.8,42.71 50.16,43.35 IC1.21 36.51,43.35 33.81,45.89 33.02,46.68 IC16.14
  Bottom 0.254: v62.62,43.66 63.26,43.66 63.81,42.87 65.64,42.87 66.19,43.58 66.75,43.98 72.86,43.98 73.26,43.74 75.32,43.74 77.15,42.87 v76.91,43.19
DETECT
  Bottom 0.305: U$12.CD 130.65,69.7 131.44,70.49 R4.1
DONE  (via drill 0.5, 0.6)
  Top 0.254: R29.1 v95.09,14.29 95.09,16.68 97.31,18.9 97.31,23.82 v98.58,25.09 | v99.85,68.9 96.83,68.75 95.24,67.15 U$2.71 | IC3.4 105.41,37.95 106.04,37.31 v106.04,37.15 107.31,37.15 107.79,36.68 IC3.10 | v103.82,42.87 103.82,41.86 IC3.1